# Altium project diplomka_hiearchical.PrjPcb (part 1 of 4)
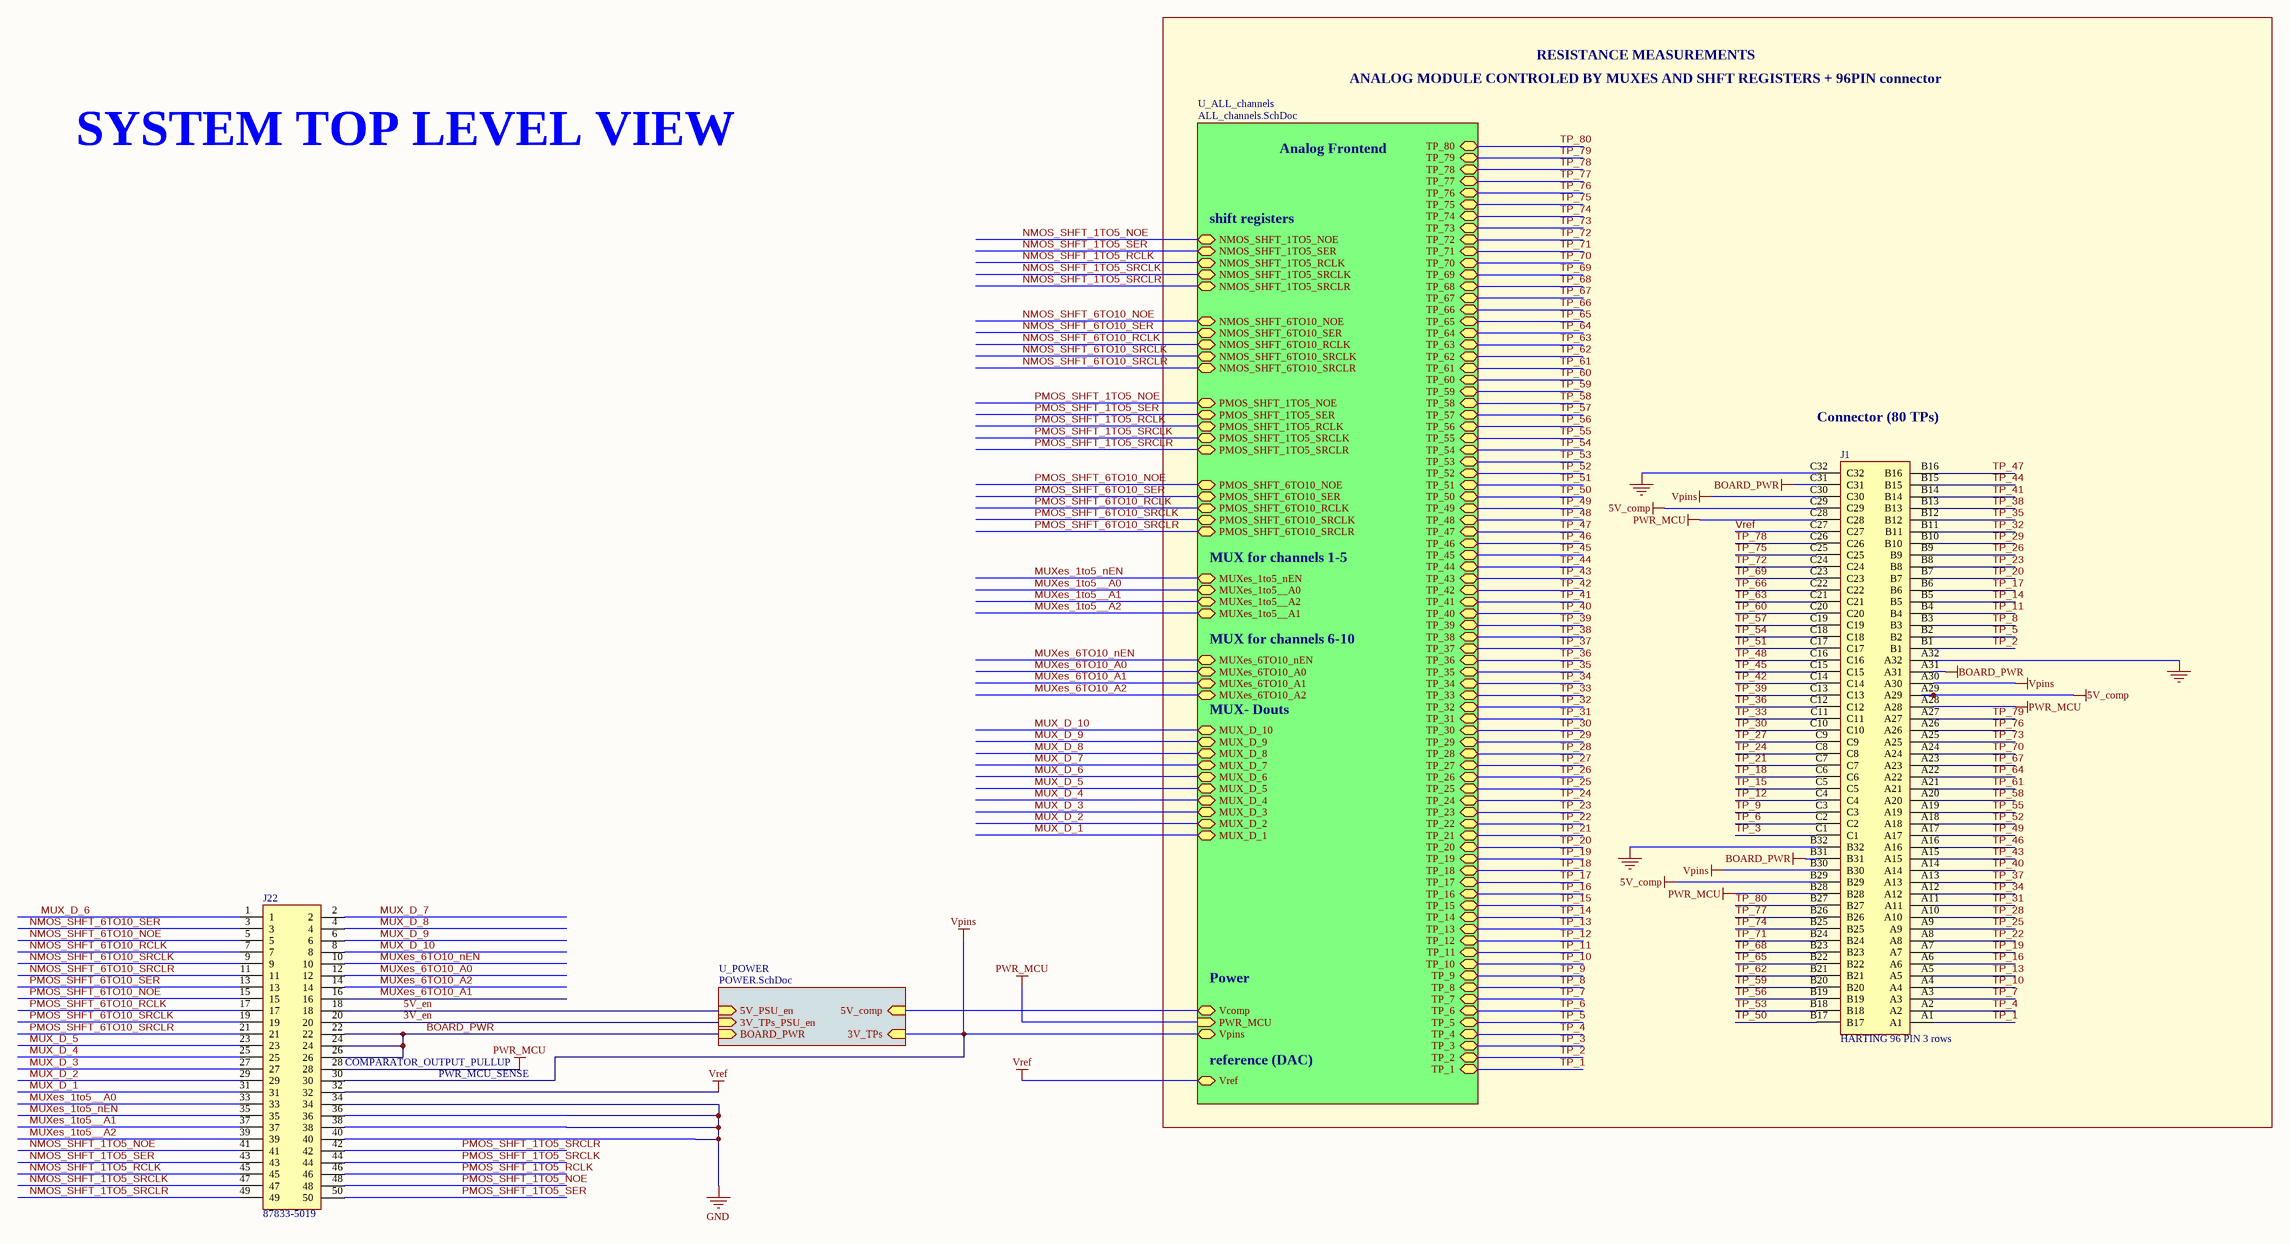
[diagram p0: main_scheme.SchDoc]
5 sheets, 444 parts. Net scope: hierarchical (ports join the sheet entries above them; power ports are global).
Board file: PCB1.PcbDoc
Sheets:
  main_scheme.SchDoc
    U_ALL_channels = ALL_channels.SchDoc
      8pins1 = 8pins_together.SchDoc
        dTP = TPs.SchDoc
        dTP = TPs.SchDoc
        dTP = TPs.SchDoc
        dTP = TPs.SchDoc
      8pins2 = 8pins_together.SchDoc
        dTP = TPs.SchDoc
        dTP = TPs.SchDoc
        dTP = TPs.SchDoc
        dTP = TPs.SchDoc
      8pins3 = 8pins_together.SchDoc
        dTP = TPs.SchDoc
        dTP = TPs.SchDoc
        dTP = TPs.SchDoc
        dTP = TPs.SchDoc
      8pins4 = 8pins_together.SchDoc
        dTP = TPs.SchDoc
        dTP = TPs.SchDoc
        dTP = TPs.SchDoc
        dTP = TPs.SchDoc
      8pins5 = 8pins_together.SchDoc
        dTP = TPs.SchDoc
        dTP = TPs.SchDoc
        dTP = TPs.SchDoc
        dTP = TPs.SchDoc
      8pins6 = 8pins_together.SchDoc
        dTP = TPs.SchDoc
        dTP = TPs.SchDoc
        dTP = TPs.SchDoc
        dTP = TPs.SchDoc
      8pins7 = 8pins_together.SchDoc
        dTP = TPs.SchDoc
        dTP = TPs.SchDoc
        dTP = TPs.SchDoc
        dTP = TPs.SchDoc
      8pins8 = 8pins_together.SchDoc
        dTP = TPs.SchDoc
        dTP = TPs.SchDoc
        dTP = TPs.SchDoc
        dTP = TPs.SchDoc
      8pins9 = 8pins_together.SchDoc
        dTP = TPs.SchDoc
        dTP = TPs.SchDoc
        dTP = TPs.SchDoc
        dTP = TPs.SchDoc
      8pins10 = 8pins_together.SchDoc
        dTP = TPs.SchDoc
        dTP = TPs.SchDoc
        dTP = TPs.SchDoc
        dTP = TPs.SchDoc
    U_POWER = POWER.SchDoc

## Sheet main_scheme.SchDoc
size A2; DocumentNumber: 1; SheetNumber: 1; SheetTotal: 5

### Parts
J1  HARTING 96 PIN 3 rows  [09033966921]
J22  87833-5019  [SHDRRA50W55P200_2X25_5265X640X630P]

### Sub-sheets
U_ALL_channels = ALL_channels.SchDoc: NMOS_SHFT_1TO5_SER (bidir), NMOS_SHFT_1TO5_NOE (bidir), NMOS_SHFT_1TO5_SRCLR (bidir), NMOS_SHFT_1TO5_SRCLK (bidir), NMOS_SHFT_1TO5_RCLK (bidir), PMOS_SHFT_1TO5_SER (bidir), PMOS_SHFT_1TO5_NOE (bidir), PMOS_SHFT_1TO5_SRCLR (bidir), PMOS_SHFT_1TO5_SRCLK (bidir), PMOS_SHFT_1TO5_RCLK (bidir), TP_1 (bidir), TP_2 (bidir), TP_3 (bidir), TP_4 (bidir), TP_5 (bidir), TP_6 (bidir), TP_7 (bidir), TP_8 (bidir), TP_9 (bidir), TP_10 (bidir), TP_11 (bidir), TP_12 (bidir), TP_13 (bidir), TP_14 (bidir), TP_15 (bidir), TP_16 (bidir), TP_17 (bidir), TP_18 (bidir), TP_19 (bidir), TP_20 (bidir), TP_21 (bidir), TP_22 (bidir), TP_23 (bidir), TP_24 (bidir), TP_25 (bidir), TP_26 (bidir), TP_27 (bidir), TP_28 (bidir), TP_29 (bidir), TP_30 (bidir), TP_31 (bidir), TP_32 (bidir), TP_33 (bidir), TP_34 (bidir), TP_35 (bidir), TP_36 (bidir), TP_37 (bidir), TP_38 (bidir), TP_39 (bidir), TP_40 (bidir), MUX_D_1 (bidir), NMOS_SHFT_6TO10_SER (bidir), NMOS_SHFT_6TO10_NOE (bidir), NMOS_SHFT_6TO10_SRCLR (bidir), NMOS_SHFT_6TO10_SRCLK (bidir), NMOS_SHFT_6TO10_RCLK (bidir), PMOS_SHFT_6TO10_SER (bidir), PMOS_SHFT_6TO10_NOE (bidir), PMOS_SHFT_6TO10_SRCLR (bidir), PMOS_SHFT_6TO10_SRCLK (bidir), PMOS_SHFT_6TO10_RCLK (bidir), MUX_D_2 (bidir), MUX_D_3 (bidir), MUX_D_4 (bidir), MUX_D_5 (bidir), MUX_D_6 (bidir), MUX_D_7 (bidir), MUX_D_8 (bidir), MUX_D_9 (bidir), MUX_D_10 (bidir), MUXes_1to5_nEN (bidir), MUXes_1to5__A0 (bidir), MUXes_1to5__A1 (bidir), MUXes_1to5__A2 (bidir), MUXes_6TO10_nEN (bidir), MUXes_6TO10_A0 (bidir), MUXes_6TO10_A1 (bidir), MUXes_6TO10_A2 (bidir), TP_41 (bidir), TP_42 (bidir), TP_43 (bidir), TP_44 (bidir), TP_45 (bidir), TP_46 (bidir), TP_47 (bidir), TP_48 (bidir), TP_49 (bidir), TP_50 (bidir), TP_51 (bidir), TP_52 (bidir), TP_53 (bidir), TP_54 (bidir), TP_55 (bidir), TP_56 (bidir), TP_57 (bidir), TP_58 (bidir), TP_59 (bidir), TP_60 (bidir), TP_61 (bidir), TP_62 (bidir), TP_63 (bidir), TP_64 (bidir), TP_65 (bidir), TP_66 (bidir), TP_67 (bidir), TP_68 (bidir), TP_69 (bidir), TP_70 (bidir), TP_71 (bidir), TP_72 (bidir), TP_73 (bidir), TP_74 (bidir), TP_75 (bidir), TP_76 (bidir), TP_77 (bidir), TP_78 (bidir), TP_79 (bidir), TP_80 (bidir), Vcomp (bidir), Vref (bidir), PWR_MCU (in), Vpins (bidir)
U_POWER = POWER.SchDoc: 3V_TPs (in), 3V_TPs_PSU_en (in), 5V_PSU_en (in), BOARD_PWR (in), 5V_comp (in)

### Nets
5V_comp: J1.A29 J1.B29 J1.C29
BOARD_PWR: J1.A31 J1.B31 J1.C31 J22.22 J22.24 J22.26 ; sheet U_POWER/BOARD_PWR
GND: J1.A32 J1.B32 J1.C32 J22.34 J22.36 J22.38 J22.40
PWR_MCU: J1.A28 J1.B28 J1.C28 J22.28 ; sheet U_ALL_channels/PWR_MCU
Vpins: J1.A30 J1.B30 J1.C30 J22.30 ; sheet U_ALL_channels/Vpins, sheet U_POWER/3V_TPs
Vref: J1.C27 J22.32 ; sheet U_ALL_channels/Vref
3V_en: J22.20 ; sheet U_POWER/3V_TPs_PSU_en
5V_en: J22.18 ; sheet U_POWER/5V_PSU_en
MUX_D_1: J22.31 ; sheet U_ALL_channels/MUX_D_1
MUX_D_2: J22.29 ; sheet U_ALL_channels/MUX_D_2
MUX_D_3: J22.27 ; sheet U_ALL_channels/MUX_D_3
MUX_D_4: J22.25 ; sheet U_ALL_channels/MUX_D_4
MUX_D_5: J22.23 ; sheet U_ALL_channels/MUX_D_5
MUX_D_6: J22.1 ; sheet U_ALL_channels/MUX_D_6
MUX_D_7: J22.2 ; sheet U_ALL_channels/MUX_D_7
MUX_D_8: J22.4 ; sheet U_ALL_channels/MUX_D_8
MUX_D_9: J22.6 ; sheet U_ALL_channels/MUX_D_9
MUX_D_10: J22.8 ; sheet U_ALL_channels/MUX_D_10
MUXes_1to5__A0: J22.33 ; sheet U_ALL_channels/MUXes_1to5__A0
MUXes_1to5__A1: J22.37 ; sheet U_ALL_channels/MUXes_1to5__A2
MUXes_1to5__A2: J22.39 ; sheet U_ALL_channels/MUXes_1to5__A1
MUXes_1to5_nEN: J22.35 ; sheet U_ALL_channels/MUXes_1to5_nEN
MUXes_6TO10_A0: J22.12 ; sheet U_ALL_channels/MUXes_6TO10_A0
MUXes_6TO10_A1: J22.16 ; sheet U_ALL_channels/MUXes_6TO10_A1
MUXes_6TO10_A2: J22.14 ; sheet U_ALL_channels/MUXes_6TO10_A2
MUXes_6TO10_nEN: J22.10 ; sheet U_ALL_channels/MUXes_6TO10_nEN
NMOS_SHFT_1TO5_NOE: J22.41 ; sheet U_ALL_channels/NMOS_SHFT_1TO5_NOE
NMOS_SHFT_1TO5_RCLK: J22.45 ; sheet U_ALL_channels/NMOS_SHFT_1TO5_RCLK
NMOS_SHFT_1TO5_SER: J22.43 ; sheet U_ALL_channels/NMOS_SHFT_1TO5_SER
NMOS_SHFT_1TO5_SRCLK: J22.47 ; sheet U_ALL_channels/NMOS_SHFT_1TO5_SRCLK
NMOS_SHFT_1TO5_SRCLR: J22.49 ; sheet U_ALL_channels/NMOS_SHFT_1TO5_SRCLR
NMOS_SHFT_6TO10_NOE: J22.5 ; sheet U_ALL_channels/NMOS_SHFT_6TO10_NOE
NMOS_SHFT_6TO10_RCLK: J22.7 ; sheet U_ALL_channels/NMOS_SHFT_6TO10_RCLK
NMOS_SHFT_6TO10_SER: J22.3 ; sheet U_ALL_channels/NMOS_SHFT_6TO10_SER
NMOS_SHFT_6TO10_SRCLK: J22.9 ; sheet U_ALL_channels/NMOS_SHFT_6TO10_SRCLK
NMOS_SHFT_6TO10_SRCLR: J22.11 ; sheet U_ALL_channels/NMOS_SHFT_6TO10_SRCLR
PMOS_SHFT_1TO5_NOE: J22.48 ; sheet U_ALL_channels/PMOS_SHFT_1TO5_NOE
PMOS_SHFT_1TO5_RCLK: J22.46 ; sheet U_ALL_channels/PMOS_SHFT_1TO5_RCLK
PMOS_SHFT_1TO5_SER: J22.50 ; sheet U_ALL_channels/PMOS_SHFT_1TO5_SER
PMOS_SHFT_1TO5_SRCLK: J22.44 ; sheet U_ALL_channels/PMOS_SHFT_1TO5_SRCLK
PMOS_SHFT_1TO5_SRCLR: J22.42 ; sheet U_ALL_channels/PMOS_SHFT_1TO5_SRCLR
PMOS_SHFT_6TO10_NOE: J22.15 ; sheet U_ALL_channels/PMOS_SHFT_6TO10_NOE
PMOS_SHFT_6TO10_RCLK: J22.17 ; sheet U_ALL_channels/PMOS_SHFT_6TO10_RCLK
PMOS_SHFT_6TO10_SER: J22.13 ; sheet U_ALL_channels/PMOS_SHFT_6TO10_SER
PMOS_SHFT_6TO10_SRCLK: J22.19 ; sheet U_ALL_channels/PMOS_SHFT_6TO10_SRCLK
PMOS_SHFT_6TO10_SRCLR: J22.21 ; sheet U_ALL_channels/PMOS_SHFT_6TO10_SRCLR
TP_1: J1.A1 ; sheet U_ALL_channels/TP_1
TP_2: J1.B1 ; sheet U_ALL_channels/TP_2
TP_3: J1.C1 ; sheet U_ALL_channels/TP_3
TP_4: J1.A2 ; sheet U_ALL_channels/TP_4
TP_5: J1.B2 ; sheet U_ALL_channels/TP_5
TP_6: J1.C2 ; sheet U_ALL_channels/TP_6
TP_7: J1.A3 ; sheet U_ALL_channels/TP_7
TP_8: J1.B3 ; sheet U_ALL_channels/TP_8
TP_9: J1.C3 ; sheet U_ALL_channels/TP_9
TP_10: J1.A4 ; sheet U_ALL_channels/TP_10
TP_11: J1.B4 ; sheet U_ALL_channels/TP_11
TP_12: J1.C4 ; sheet U_ALL_channels/TP_12
TP_13: J1.A5 ; sheet U_ALL_channels/TP_13
TP_14: J1.B5 ; sheet U_ALL_channels/TP_14
TP_15: J1.C5 ; sheet U_ALL_channels/TP_15
TP_16: J1.A6 ; sheet U_ALL_channels/TP_16
TP_17: J1.B6 ; sheet U_ALL_channels/TP_17
TP_18: J1.C6 ; sheet U_ALL_channels/TP_18
TP_19: J1.A7 ; sheet U_ALL_channels/TP_19
TP_20: J1.B7 ; sheet U_ALL_channels/TP_20
TP_21: J1.C7 ; sheet U_ALL_channels/TP_21
TP_22: J1.A8 ; sheet U_ALL_channels/TP_22
TP_23: J1.B8 ; sheet U_ALL_channels/TP_23
TP_24: J1.C8 ; sheet U_ALL_channels/TP_24
TP_25: J1.A9 ; sheet U_ALL_channels/TP_25
TP_26: J1.B9 ; sheet U_ALL_channels/TP_26
TP_27: J1.C9 ; sheet U_ALL_channels/TP_27
TP_28: J1.A10 ; sheet U_ALL_channels/TP_28
TP_29: J1.B10 ; sheet U_ALL_channels/TP_29
TP_30: J1.C10 ; sheet U_ALL_channels/TP_30
TP_31: J1.A11 ; sheet U_ALL_channels/TP_31
TP_32: J1.B11 ; sheet U_ALL_channels/TP_32
TP_33: J1.C11 ; sheet U_ALL_channels/TP_33
TP_34: J1.A12 ; sheet U_ALL_channels/TP_34
TP_35: J1.B12 ; sheet U_ALL_channels/TP_35
TP_36: J1.C12 ; sheet U_ALL_channels/TP_36
TP_37: J1.A13 ; sheet U_ALL_channels/TP_37
TP_38: J1.B13 ; sheet U_ALL_channels/TP_38
TP_39: J1.C13 ; sheet U_ALL_channels/TP_39
TP_40: J1.A14 ; sheet U_ALL_channels/TP_40
TP_41: J1.B14 ; sheet U_ALL_channels/TP_41
TP_42: J1.C14 ; sheet U_ALL_channels/TP_42
TP_43: J1.A15 ; sheet U_ALL_channels/TP_43
TP_44: J1.B15 ; sheet U_ALL_channels/TP_44
TP_45: J1.C15 ; sheet U_ALL_channels/TP_45
TP_46: J1.A16 ; sheet U_ALL_channels/TP_46
TP_47: J1.B16 ; sheet U_ALL_channels/TP_47
TP_48: J1.C16 ; sheet U_ALL_channels/TP_48
TP_49: J1.A17 ; sheet U_ALL_channels/TP_49
TP_50: J1.B17 ; sheet U_ALL_channels/TP_50
TP_51: J1.C17 ; sheet U_ALL_channels/TP_51
TP_52: J1.A18 ; sheet U_ALL_channels/TP_52
TP_53: J1.B18 ; sheet U_ALL_channels/TP_53
TP_54: J1.C18 ; sheet U_ALL_channels/TP_54
TP_55: J1.A19 ; sheet U_ALL_channels/TP_55
TP_56: J1.B19 ; sheet U_ALL_channels/TP_56
TP_57: J1.C19 ; sheet U_ALL_channels/TP_57
TP_58: J1.A20 ; sheet U_ALL_channels/TP_58
TP_59: J1.B20 ; sheet U_ALL_channels/TP_59
TP_60: J1.C20 ; sheet U_ALL_channels/TP_60
TP_61: J1.A21 ; sheet U_ALL_channels/TP_61
TP_62: J1.B21 ; sheet U_ALL_channels/TP_62
TP_63: J1.C21 ; sheet U_ALL_channels/TP_63
TP_64: J1.A22 ; sheet U_ALL_channels/TP_64
TP_65: J1.B22 ; sheet U_ALL_channels/TP_65
TP_66: J1.C22 ; sheet U_ALL_channels/TP_66
TP_67: J1.A23 ; sheet U_ALL_channels/TP_67
TP_68: J1.B23 ; sheet U_ALL_channels/TP_68
TP_69: J1.C23 ; sheet U_ALL_channels/TP_69
TP_70: J1.A24 ; sheet U_ALL_channels/TP_70
TP_71: J1.B24 ; sheet U_ALL_channels/TP_71
TP_72: J1.C24 ; sheet U_ALL_channels/TP_72
TP_73: J1.A25 ; sheet U_ALL_channels/TP_73
TP_74: J1.B25 ; sheet U_ALL_channels/TP_74
TP_75: J1.C25 ; sheet U_ALL_channels/TP_75
TP_76: J1.A26 ; sheet U_ALL_channels/TP_76
TP_77: J1.B26 ; sheet U_ALL_channels/TP_77
TP_78: J1.C26 ; sheet U_ALL_channels/TP_78
TP_79: J1.A27 ; sheet U_ALL_channels/TP_79
TP_80: J1.B27 ; sheet U_ALL_channels/TP_80
Vcomp: sheet U_ALL_channels/Vcomp, sheet U_POWER/5V_comp

### Notes on the sheet
- RESISTANCE MEASUREMENTS
- ANALOG MODULE CONTROLED BY MUXES AND SHFT REGISTERS + 96PIN connector
- SYSTEM TOP LEVEL VIEW
- Analog Frontend
- shift registers
- Connector (80 TPs)
- MUX for channels 1-5
- MUX for channels 6-10
- MUX- Douts
- Power
- (near J22) COMPARATOR_OUTPUT_PULLUP
- reference (DAC)
- PWR_MCU_SENSE

### Library data of the parts
J1 = HARTING 96 PIN 3 rows: Connector; Datasheet Link: https://b2b.harting.com/files/download/PRD/PDF_TS/0903396X921_100072506DRW414C.pdf?showPrivacyEmailAgreement=false&contextURL=https%3A%2F%2Fb2b.harting.com%2Febusiness%2Fen_us&siteName=Ebusiness+Site&autoLogoutEnabled=true&autoLogoutTime=1800; Height: 11.6mm; Manufacturer_Name: HARTING; Manufacturer_Part_Number: 09033966921; Mouser Part Number: 617-09-03-396-6921; Mouser Price/Stock: https://www.mouser.co.uk/ProductDetail/HARTING/09033966921?qs=gIpPgrDBK%2FiSDuMebe5eaQ%3D%3D; Arrow Part Number: 09033966921; Arrow Price/Stock: https://www.arrow.com/en/products/09033966921/harting?region=europe
J22 = 87833-5019: Connector; Manufacturer_Name: Molex; Datasheet Link: https://www.molex.com/pdm_docs/sd/878335019_sd.pdf; Height: 6.3mm; Manufacturer_Part_Number: 87833-5019; Mouser Part Number: 538-87833-5019; Mouser Price/Stock: https://www.mouser.co.uk/ProductDetail/Molex/87833-5019?qs=Vr3ZXvgdfhbSPmsYnBrhlw%3D%3D

## Sheet ALL_channels.SchDoc
size A2; DocumentNumber: 4; SheetNumber: 2; SheetTotal: 5
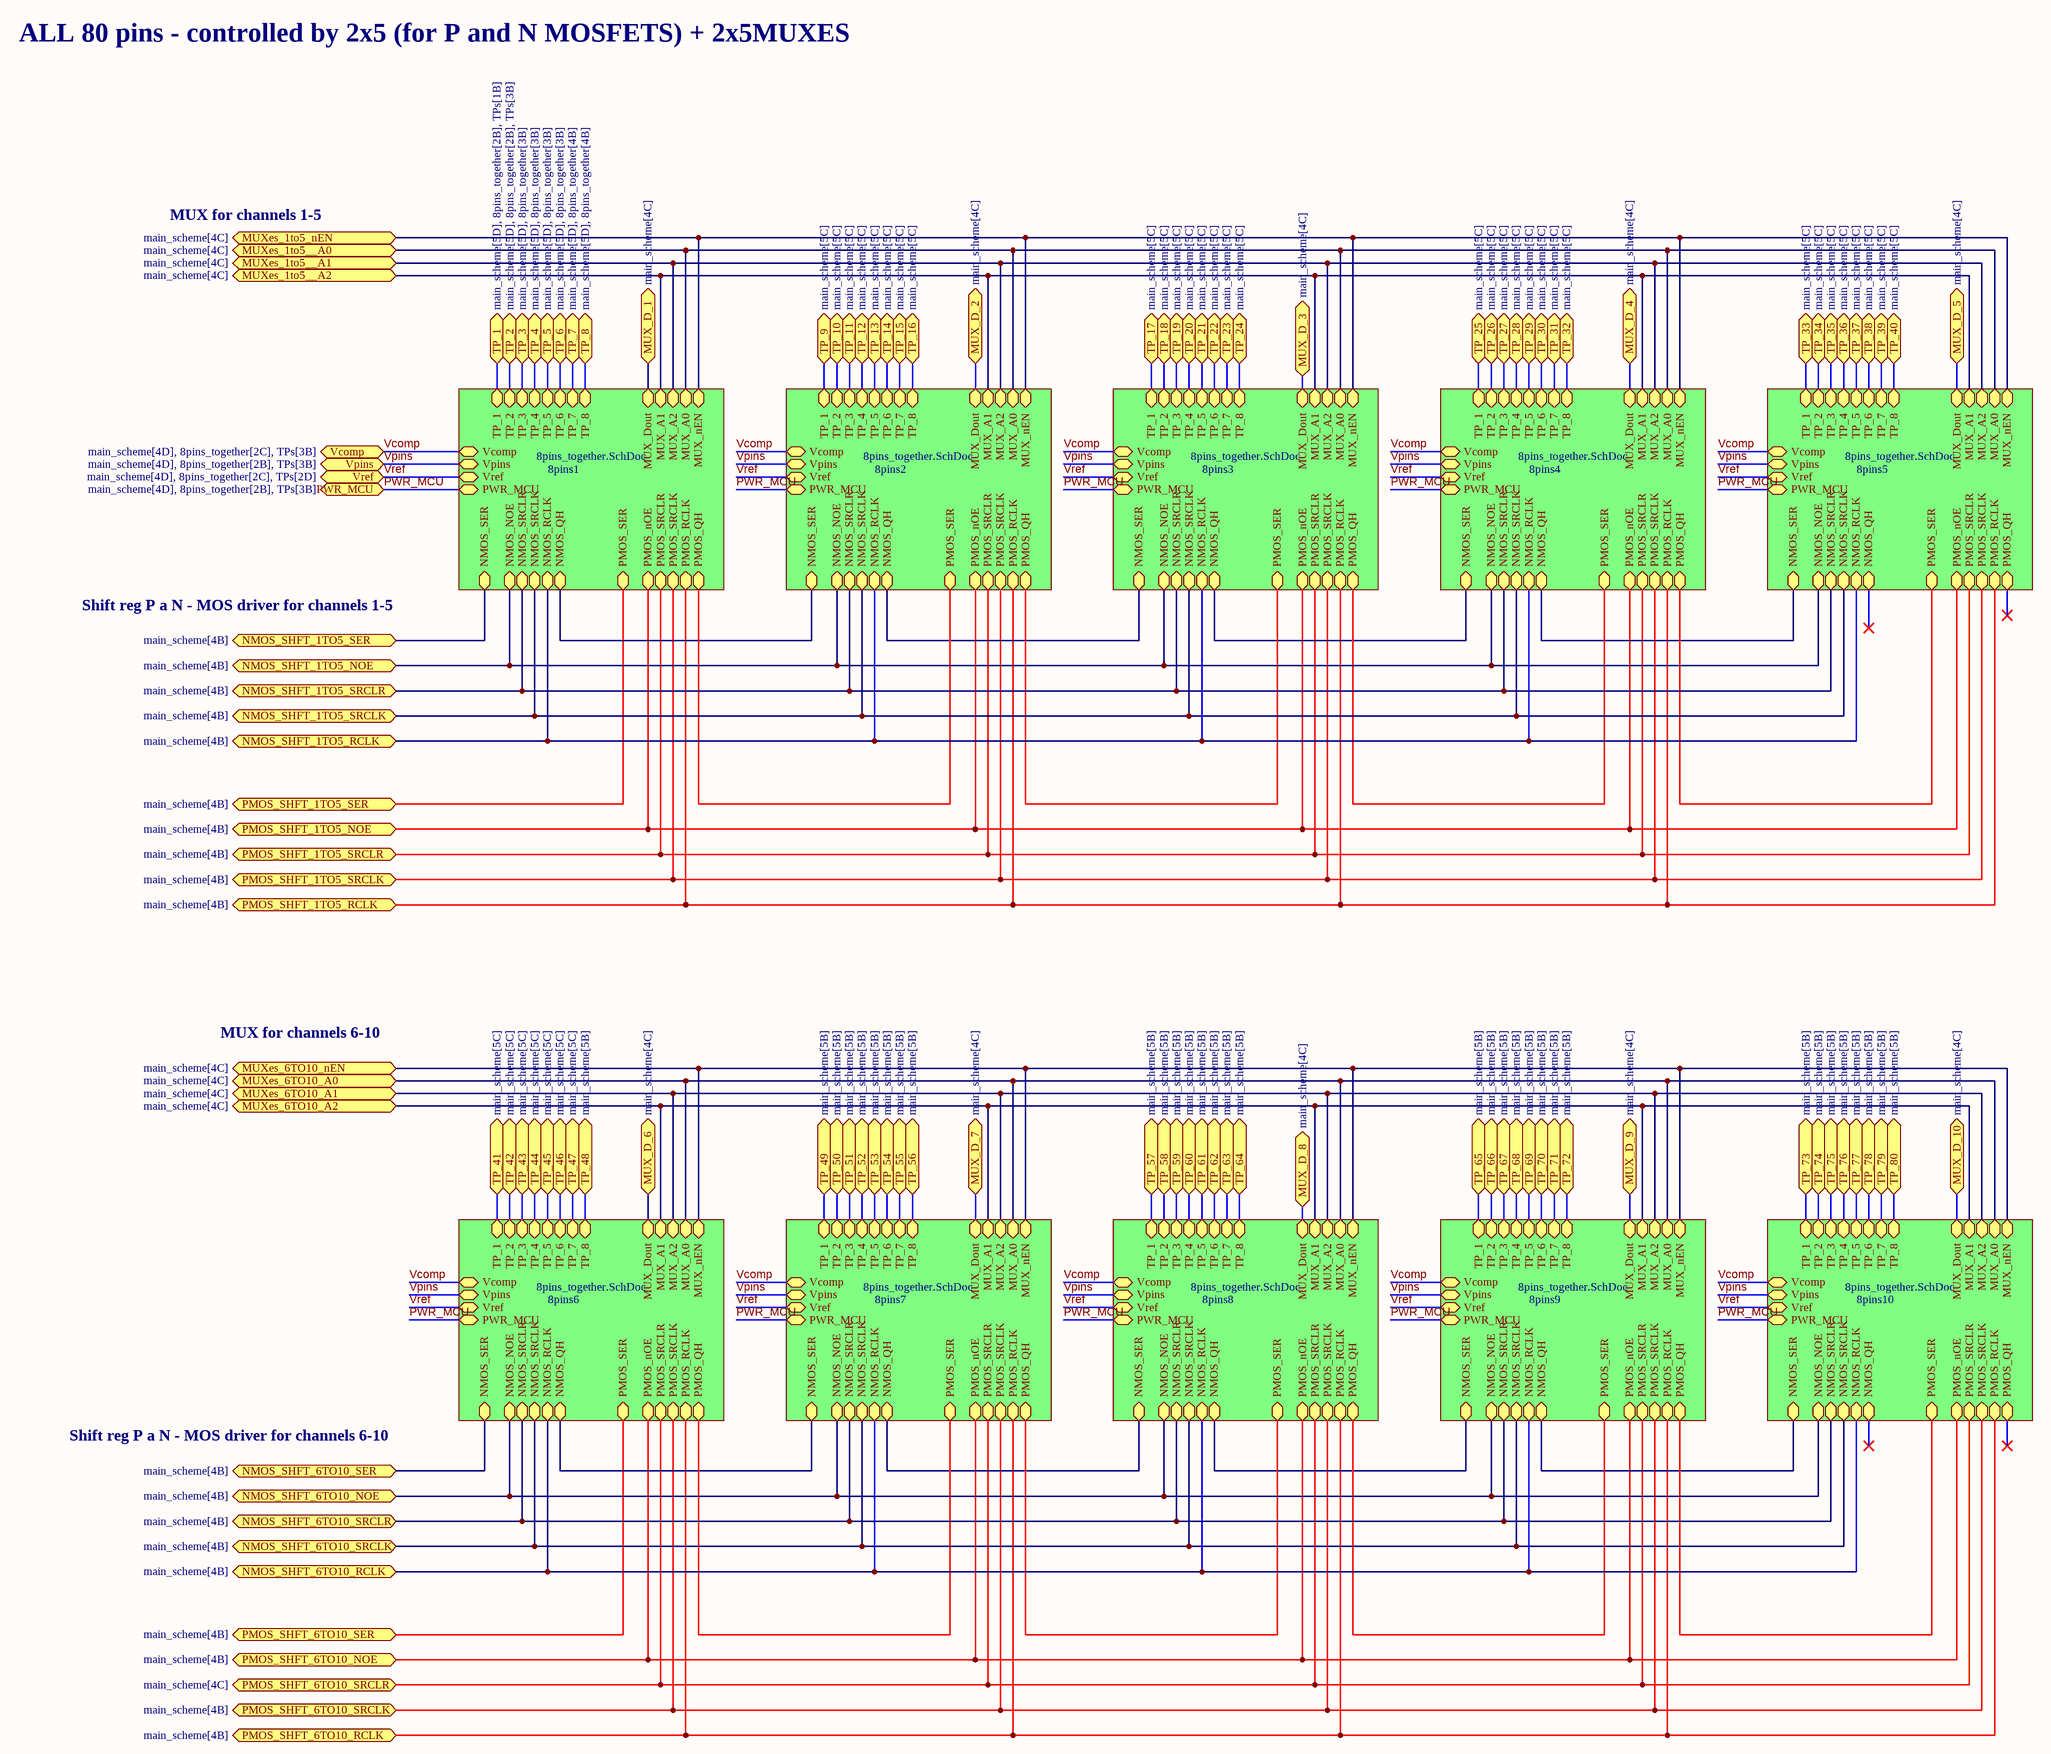
[diagram p1: ALL_channels.SchDoc]

### Sub-sheets
8pins1 = 8pins_together.SchDoc: TP_1 (bidir), TP_2 (bidir), TP_3 (bidir), TP_4 (bidir), TP_5 (bidir), TP_6 (bidir), TP_7 (bidir), TP_8 (bidir), MUX_nEN (bidir), MUX_Dout (bidir), MUX_A0 (bidir), MUX_A1 (bidir), MUX_A2 (bidir), Vcomp (bidir), Vref (bidir), PWR_MCU (bidir), Vpins (bidir), NMOS_QH (bidir), PMOS_QH (bidir), NMOS_RCLK (bidir), NMOS_NOE (bidir), NMOS_SRCLK (bidir), NMOS_SRCLR (bidir), NMOS_SER (bidir), PMOS_RCLK (bidir), PMOS_nOE (bidir), PMOS_SRCLK (bidir), PMOS_SRCLR (bidir), PMOS_SER (bidir)
8pins2 = 8pins_together.SchDoc: TP_1 (bidir), TP_2 (bidir), TP_3 (bidir), TP_4 (bidir), TP_5 (bidir), TP_6 (bidir), TP_7 (bidir), TP_8 (bidir), MUX_nEN (bidir), MUX_Dout (bidir), MUX_A0 (bidir), MUX_A1 (bidir), MUX_A2 (bidir), Vcomp (bidir), Vref (bidir), PWR_MCU (bidir), Vpins (bidir), NMOS_QH (bidir), PMOS_QH (bidir), NMOS_RCLK (bidir), NMOS_NOE (bidir), NMOS_SRCLK (bidir), NMOS_SRCLR (bidir), NMOS_SER (bidir), PMOS_RCLK (bidir), PMOS_nOE (bidir), PMOS_SRCLK (bidir), PMOS_SRCLR (bidir), PMOS_SER (bidir)
8pins3 = 8pins_together.SchDoc: TP_1 (bidir), TP_2 (bidir), TP_3 (bidir), TP_4 (bidir), TP_5 (bidir), TP_6 (bidir), TP_7 (bidir), TP_8 (bidir), MUX_nEN (bidir), MUX_Dout (bidir), MUX_A0 (bidir), MUX_A1 (bidir), MUX_A2 (bidir), Vcomp (bidir), Vref (bidir), PWR_MCU (bidir), Vpins (bidir), NMOS_QH (bidir), PMOS_QH (bidir), NMOS_RCLK (bidir), NMOS_NOE (bidir), NMOS_SRCLK (bidir), NMOS_SRCLR (bidir), NMOS_SER (bidir), PMOS_RCLK (bidir), PMOS_nOE (bidir), PMOS_SRCLK (bidir), PMOS_SRCLR (bidir), PMOS_SER (bidir)
8pins4 = 8pins_together.SchDoc: TP_1 (bidir), TP_2 (bidir), TP_3 (bidir), TP_4 (bidir), TP_5 (bidir), TP_6 (bidir), TP_7 (bidir), TP_8 (bidir), MUX_nEN (bidir), MUX_Dout (bidir), MUX_A0 (bidir), MUX_A1 (bidir), MUX_A2 (bidir), Vcomp (bidir), Vref (bidir), PWR_MCU (bidir), Vpins (bidir), NMOS_QH (bidir), PMOS_QH (bidir), NMOS_RCLK (bidir), NMOS_NOE (bidir), NMOS_SRCLK (bidir), NMOS_SRCLR (bidir), NMOS_SER (bidir), PMOS_RCLK (bidir), PMOS_nOE (bidir), PMOS_SRCLK (bidir), PMOS_SRCLR (bidir), PMOS_SER (bidir)
8pins5 = 8pins_together.SchDoc: TP_1 (bidir), TP_2 (bidir), TP_3 (bidir), TP_4 (bidir), TP_5 (bidir), TP_6 (bidir), TP_7 (bidir), TP_8 (bidir), MUX_nEN (bidir), MUX_Dout (bidir), MUX_A0 (bidir), MUX_A1 (bidir), MUX_A2 (bidir), Vcomp (bidir), Vref (bidir), PWR_MCU (bidir), Vpins (bidir), NMOS_QH (bidir), PMOS_QH (bidir), NMOS_RCLK (bidir), NMOS_NOE (bidir), NMOS_SRCLK (bidir), NMOS_SRCLR (bidir), NMOS_SER (bidir), PMOS_RCLK (bidir), PMOS_nOE (bidir), PMOS_SRCLK (bidir), PMOS_SRCLR (bidir), PMOS_SER (bidir)
8pins6 = 8pins_together.SchDoc: TP_1 (bidir), TP_2 (bidir), TP_3 (bidir), TP_4 (bidir), TP_5 (bidir), TP_6 (bidir), TP_7 (bidir), TP_8 (bidir), MUX_nEN (bidir), MUX_Dout (bidir), MUX_A0 (bidir), MUX_A1 (bidir), MUX_A2 (bidir), Vcomp (bidir), Vref (bidir), PWR_MCU (bidir), Vpins (bidir), NMOS_QH (bidir), PMOS_QH (bidir), NMOS_RCLK (bidir), NMOS_NOE (bidir), NMOS_SRCLK (bidir), NMOS_SRCLR (bidir), NMOS_SER (bidir), PMOS_RCLK (bidir), PMOS_nOE (bidir), PMOS_SRCLK (bidir), PMOS_SRCLR (bidir), PMOS_SER (bidir)
8pins7 = 8pins_together.SchDoc: TP_1 (bidir), TP_2 (bidir), TP_3 (bidir), TP_4 (bidir), TP_5 (bidir), TP_6 (bidir), TP_7 (bidir), TP_8 (bidir), MUX_nEN (bidir), MUX_Dout (bidir), MUX_A0 (bidir), MUX_A1 (bidir), MUX_A2 (bidir), Vcomp (bidir), Vref (bidir), PWR_MCU (bidir), Vpins (bidir), NMOS_QH (bidir), PMOS_QH (bidir), NMOS_RCLK (bidir), NMOS_NOE (bidir), NMOS_SRCLK (bidir), NMOS_SRCLR (bidir), NMOS_SER (bidir), PMOS_RCLK (bidir), PMOS_nOE (bidir), PMOS_SRCLK (bidir), PMOS_SRCLR (bidir), PMOS_SER (bidir)
8pins8 = 8pins_together.SchDoc: TP_1 (bidir), TP_2 (bidir), TP_3 (bidir), TP_4 (bidir), TP_5 (bidir), TP_6 (bidir), TP_7 (bidir), TP_8 (bidir), MUX_nEN (bidir), MUX_Dout (bidir), MUX_A0 (bidir), MUX_A1 (bidir), MUX_A2 (bidir), Vcomp (bidir), Vref (bidir), PWR_MCU (bidir), Vpins (bidir), NMOS_QH (bidir), PMOS_QH (bidir), NMOS_RCLK (bidir), NMOS_NOE (bidir), NMOS_SRCLK (bidir), NMOS_SRCLR (bidir), NMOS_SER (bidir), PMOS_RCLK (bidir), PMOS_nOE (bidir), PMOS_SRCLK (bidir), PMOS_SRCLR (bidir), PMOS_SER (bidir)
8pins9 = 8pins_together.SchDoc: TP_1 (bidir), TP_2 (bidir), TP_3 (bidir), TP_4 (bidir), TP_5 (bidir), TP_6 (bidir), TP_7 (bidir), TP_8 (bidir), MUX_nEN (bidir), MUX_Dout (bidir), MUX_A0 (bidir), MUX_A1 (bidir), MUX_A2 (bidir), Vcomp (bidir), Vref (bidir), PWR_MCU (bidir), Vpins (bidir), NMOS_QH (bidir), PMOS_QH (bidir), NMOS_RCLK (bidir), NMOS_NOE (bidir), NMOS_SRCLK (bidir), NMOS_SRCLR (bidir), NMOS_SER (bidir), PMOS_RCLK (bidir), PMOS_nOE (bidir), PMOS_SRCLK (bidir), PMOS_SRCLR (bidir), PMOS_SER (bidir)
8pins10 = 8pins_together.SchDoc: TP_1 (bidir), TP_2 (bidir), TP_3 (bidir), TP_4 (bidir), TP_5 (bidir), TP_6 (bidir), TP_7 (bidir), TP_8 (bidir), MUX_nEN (bidir), MUX_Dout (bidir), MUX_A0 (bidir), MUX_A1 (bidir), MUX_A2 (bidir), Vcomp (bidir), Vref (bidir), PWR_MCU (bidir), Vpins (bidir), NMOS_QH (bidir), PMOS_QH (bidir), NMOS_RCLK (bidir), NMOS_NOE (bidir), NMOS_SRCLK (bidir), NMOS_SRCLR (bidir), NMOS_SER (bidir), PMOS_RCLK (bidir), PMOS_nOE (bidir), PMOS_SRCLK (bidir), PMOS_SRCLR (bidir), PMOS_SER (bidir)

### Ports
MUX_D_1 (bidir, see main_scheme[4C]), MUX_D_2 (bidir, see main_scheme[4C]), MUX_D_3 (bidir, see main_scheme[4C]), MUX_D_4 (bidir, see main_scheme[4C]), MUX_D_5 (bidir, see main_scheme[4C]), MUX_D_6 (bidir, see main_scheme[4C]), MUX_D_7 (bidir, see main_scheme[4C]), MUX_D_8 (bidir, see main_scheme[4C]), MUX_D_9 (bidir, see main_scheme[4C]), MUX_D_10 (bidir, see main_scheme[4C]), MUXes_1to5__A0 (bidir, see main_scheme[4C]), MUXes_1to5__A1 (bidir, see main_scheme[4C]), MUXes_1to5__A2 (bidir, see main_scheme[4C]), MUXes_1to5_nEN (bidir, see main_scheme[4C]), MUXes_6TO10_A0 (bidir, see main_scheme[4C]), MUXes_6TO10_A1 (bidir, see main_scheme[4C]), MUXes_6TO10_A2 (bidir, see main_scheme[4C]), MUXes_6TO10_nEN (bidir, see main_scheme[4C]), NMOS_SHFT_1TO5_NOE (bidir, see main_scheme[4B]), NMOS_SHFT_1TO5_RCLK (bidir, see main_scheme[4B]), NMOS_SHFT_1TO5_SER (bidir, see main_scheme[4B]), NMOS_SHFT_1TO5_SRCLK (bidir, see main_scheme[4B]), NMOS_SHFT_1TO5_SRCLR (bidir, see main_scheme[4B]), NMOS_SHFT_6TO10_NOE (bidir, see main_scheme[4B]), NMOS_SHFT_6TO10_RCLK (bidir, see main_scheme[4B]), NMOS_SHFT_6TO10_SER (bidir, see main_scheme[4B]), NMOS_SHFT_6TO10_SRCLK (bidir, see main_scheme[4B]), NMOS_SHFT_6TO10_SRCLR (bidir, see main_scheme[4B]), PMOS_SHFT_1TO5_NOE (bidir, see main_scheme[4B]), PMOS_SHFT_1TO5_RCLK (bidir, see main_scheme[4B]), PMOS_SHFT_1TO5_SER (bidir, see main_scheme[4B]), PMOS_SHFT_1TO5_SRCLK (bidir, see main_scheme[4B]), PMOS_SHFT_1TO5_SRCLR (bidir, see main_scheme[4B]), PMOS_SHFT_6TO10_NOE (bidir, see main_scheme[4B]), PMOS_SHFT_6TO10_RCLK (bidir, see main_scheme[4B]), PMOS_SHFT_6TO10_SER (bidir, see main_scheme[4B]), PMOS_SHFT_6TO10_SRCLK (bidir, see main_scheme[4B]), PMOS_SHFT_6TO10_SRCLR (bidir, see main_scheme[4C]), PWR_MCU (bidir, see main_scheme[4D], 8pins_together[2B], TPs[3B]), TP_1 (bidir, see main_scheme[5D], 8pins_together[2B], TPs[1B]), TP_2 (bidir, see main_scheme[5D], 8pins_together[2B], TPs[3B]), TP_3 (bidir, see main_scheme[5D], 8pins_together[3B]), TP_4 (bidir, see main_scheme[5D], 8pins_together[3B]), TP_5 (bidir, see main_scheme[5D], 8pins_together[3B]), TP_6 (bidir, see main_scheme[5D], 8pins_together[3B]), TP_7 (bidir, see main_scheme[5D], 8pins_together[4B]), TP_8 (bidir, see main_scheme[5D], 8pins_together[4B]), TP_9 (bidir, see main_scheme[5C]), TP_10 (bidir, see main_scheme[5C]), TP_11 (bidir, see main_scheme[5C]), TP_12 (bidir, see main_scheme[5C]), TP_13 (bidir, see main_scheme[5C]), TP_14 (bidir, see main_scheme[5C]), TP_15 (bidir, see main_scheme[5C]), TP_16 (bidir, see main_scheme[5C]), TP_17 (bidir, see main_scheme[5C]), TP_18 (bidir, see main_scheme[5C]), TP_19 (bidir, see main_scheme[5C]), TP_20 (bidir, see main_scheme[5C]), TP_21 (bidir, see main_scheme[5C]), TP_22 (bidir, see main_scheme[5C]), TP_23 (bidir, see main_scheme[5C]), TP_24 (bidir, see main_scheme[5C]), TP_25 (bidir, see main_scheme[5C]), TP_26 (bidir, see main_scheme[5C]), TP_27 (bidir, see main_scheme[5C]), TP_28 (bidir, see main_scheme[5C]), TP_29 (bidir, see main_scheme[5C]), TP_30 (bidir, see main_scheme[5C]), TP_31 (bidir, see main_scheme[5C]), TP_32 (bidir, see main_scheme[5C]), TP_33 (bidir, see main_scheme[5C]), TP_34 (bidir, see main_scheme[5C]), TP_35 (bidir, see main_scheme[5C]), TP_36 (bidir, see main_scheme[5C]), TP_37 (bidir, see main_scheme[5C]), TP_38 (bidir, see main_scheme[5C]), TP_39 (bidir, see main_scheme[5C]), TP_40 (bidir, see main_scheme[5C]), TP_41 (bidir, see main_scheme[5C]), TP_42 (bidir, see main_scheme[5C]), TP_43 (bidir, see main_scheme[5C]), TP_44 (bidir, see main_scheme[5C]), TP_45 (bidir, see main_scheme[5C]), TP_46 (bidir, see main_scheme[5C]), TP_47 (bidir, see main_scheme[5C]), TP_48 (bidir, see main_scheme[5B]), TP_49 (bidir, see main_scheme[5B]), TP_50 (bidir, see main_scheme[5B]), TP_51 (bidir, see main_scheme[5B]), TP_52 (bidir, see main_scheme[5B]), TP_53 (bidir, see main_scheme[5B]), TP_54 (bidir, see main_scheme[5B]), TP_55 (bidir, see main_scheme[5B]), TP_56 (bidir, see main_scheme[5B]), TP_57 (bidir, see main_scheme[5B]), TP_58 (bidir, see main_scheme[5B]), TP_59 (bidir, see main_scheme[5B]), TP_60 (bidir, see main_scheme[5B]), TP_61 (bidir, see main_scheme[5B]), TP_62 (bidir, see main_scheme[5B]), TP_63 (bidir, see main_scheme[5B]), TP_64 (bidir, see main_scheme[5B]), TP_65 (bidir, see main_scheme[5B]), TP_66 (bidir, see main_scheme[5B]), TP_67 (bidir, see main_scheme[5B]), TP_68 (bidir, see main_scheme[5B]), TP_69 (bidir, see main_scheme[5B]), TP_70 (bidir, see main_scheme[5B]), TP_71 (bidir, see main_scheme[5B]), TP_72 (bidir, see main_scheme[5B]), TP_73 (bidir, see main_scheme[5B]), TP_74 (bidir, see main_scheme[5B]), TP_75 (bidir, see main_scheme[5B]), TP_76 (bidir, see main_scheme[5B]), TP_77 (bidir, see main_scheme[5B]), TP_78 (bidir, see main_scheme[5B]), TP_79 (bidir, see main_scheme[5B]), TP_80 (bidir, see main_scheme[5B]), Vcomp (bidir, see main_scheme[4D], 8pins_together[2C], TPs[3B]), Vpins (bidir, see main_scheme[4D], 8pins_together[2B], TPs[3B]), Vref (bidir, see main_scheme[4D], 8pins_together[2C], TPs[2D])

### Nets
PWR_MCU: port PWR_MCU, sheet 8pins1/PWR_MCU, sheet 8pins2/PWR_MCU, sheet 8pins3/PWR_MCU, sheet 8pins4/PWR_MCU, sheet 8pins5/PWR_MCU, sheet 8pins6/PWR_MCU, sheet 8pins7/PWR_MCU, sheet 8pins8/PWR_MCU, sheet 8pins9/PWR_MCU, sheet 8pins10/PWR_MCU
Vpins: port Vpins, sheet 8pins1/Vpins, sheet 8pins2/Vpins, sheet 8pins3/Vpins, sheet 8pins4/Vpins, sheet 8pins5/Vpins, sheet 8pins6/Vpins, sheet 8pins7/Vpins, sheet 8pins8/Vpins, sheet 8pins9/Vpins, sheet 8pins10/Vpins
Vref: port Vref, sheet 8pins1/Vref, sheet 8pins2/Vref, sheet 8pins3/Vref, sheet 8pins4/Vref, sheet 8pins5/Vref, sheet 8pins6/Vref, sheet 8pins7/Vref, sheet 8pins8/Vref, sheet 8pins9/Vref, sheet 8pins10/Vref
MUX_D_1: port MUX_D_1, sheet 8pins1/MUX_Dout
MUX_D_2: port MUX_D_2, sheet 8pins2/MUX_Dout
MUX_D_3: port MUX_D_3, sheet 8pins3/MUX_Dout
MUX_D_4: port MUX_D_4, sheet 8pins4/MUX_Dout
MUX_D_5: port MUX_D_5, sheet 8pins5/MUX_Dout
MUX_D_6: port MUX_D_6, sheet 8pins6/MUX_Dout
MUX_D_7: port MUX_D_7, sheet 8pins7/MUX_Dout
MUX_D_8: port MUX_D_8, sheet 8pins8/MUX_Dout
MUX_D_9: port MUX_D_9, sheet 8pins9/MUX_Dout
MUX_D_10: port MUX_D_10, sheet 8pins10/MUX_Dout
MUXes_1to5__A0: port MUXes_1to5__A0, sheet 8pins1/MUX_A0, sheet 8pins2/MUX_A0, sheet 8pins3/MUX_A0, sheet 8pins4/MUX_A0, sheet 8pins5/MUX_A0
MUXes_1to5__A1: port MUXes_1to5__A2, sheet 8pins1/MUX_A1, sheet 8pins2/MUX_A1, sheet 8pins3/MUX_A1, sheet 8pins4/MUX_A1, sheet 8pins5/MUX_A1
MUXes_1to5__A2: port MUXes_1to5__A1, sheet 8pins1/MUX_A2, sheet 8pins2/MUX_A2, sheet 8pins3/MUX_A2, sheet 8pins4/MUX_A2, sheet 8pins5/MUX_A2
MUXes_1to5_nEN: port MUXes_1to5_nEN, sheet 8pins1/MUX_nEN, sheet 8pins2/MUX_nEN, sheet 8pins3/MUX_nEN, sheet 8pins4/MUX_nEN, sheet 8pins5/MUX_nEN
MUXes_6TO10_A0: port MUXes_6TO10_A0, sheet 8pins6/MUX_A0, sheet 8pins7/MUX_A0, sheet 8pins8/MUX_A0, sheet 8pins9/MUX_A0, sheet 8pins10/MUX_A0
MUXes_6TO10_A1: port MUXes_6TO10_A1, sheet 8pins6/MUX_A2, sheet 8pins7/MUX_A2, sheet 8pins8/MUX_A2, sheet 8pins9/MUX_A2, sheet 8pins10/MUX_A2
MUXes_6TO10_A2: port MUXes_6TO10_A2, sheet 8pins6/MUX_A1, sheet 8pins7/MUX_A1, sheet 8pins8/MUX_A1, sheet 8pins9/MUX_A1, sheet 8pins10/MUX_A1
MUXes_6TO10_nEN: port MUXes_6TO10_nEN, sheet 8pins6/MUX_nEN, sheet 8pins7/MUX_nEN, sheet 8pins8/MUX_nEN, sheet 8pins9/MUX_nEN, sheet 8pins10/MUX_nEN
NMOS_SHFT_1TO5_NOE: port NMOS_SHFT_1TO5_NOE, sheet 8pins1/NMOS_NOE, sheet 8pins2/NMOS_NOE, sheet 8pins3/NMOS_NOE, sheet 8pins4/NMOS_NOE, sheet 8pins5/NMOS_NOE
NMOS_SHFT_1TO5_RCLK: port NMOS_SHFT_1TO5_RCLK, sheet 8pins1/NMOS_RCLK, sheet 8pins2/NMOS_RCLK, sheet 8pins3/NMOS_RCLK, sheet 8pins4/NMOS_RCLK, sheet 8pins5/NMOS_RCLK
NMOS_SHFT_1TO5_SER: port NMOS_SHFT_1TO5_SER, sheet 8pins1/NMOS_SER
NMOS_SHFT_1TO5_SRCLK: port NMOS_SHFT_1TO5_SRCLK, sheet 8pins1/NMOS_SRCLK, sheet 8pins2/NMOS_SRCLK, sheet 8pins3/NMOS_SRCLK, sheet 8pins4/NMOS_SRCLK, sheet 8pins5/NMOS_SRCLK
NMOS_SHFT_1TO5_SRCLR: port NMOS_SHFT_1TO5_SRCLR, sheet 8pins1/NMOS_SRCLR, sheet 8pins2/NMOS_SRCLR, sheet 8pins3/NMOS_SRCLR, sheet 8pins4/NMOS_SRCLR, sheet 8pins5/NMOS_SRCLR
NMOS_SHFT_6TO10_NOE: port NMOS_SHFT_6TO10_NOE, sheet 8pins6/NMOS_NOE, sheet 8pins7/NMOS_NOE, sheet 8pins8/NMOS_NOE, sheet 8pins9/NMOS_NOE, sheet 8pins10/NMOS_NOE
NMOS_SHFT_6TO10_RCLK: port NMOS_SHFT_6TO10_RCLK, sheet 8pins6/NMOS_RCLK, sheet 8pins7/NMOS_RCLK, sheet 8pins8/NMOS_RCLK, sheet 8pins9/NMOS_RCLK, sheet 8pins10/NMOS_RCLK
NMOS_SHFT_6TO10_SER: port NMOS_SHFT_6TO10_SER, sheet 8pins6/NMOS_SER
NMOS_SHFT_6TO10_SRCLK: port NMOS_SHFT_6TO10_SRCLK, sheet 8pins6/NMOS_SRCLK, sheet 8pins7/NMOS_SRCLK, sheet 8pins8/NMOS_SRCLK, sheet 8pins9/NMOS_SRCLK, sheet 8pins10/NMOS_SRCLK
NMOS_SHFT_6TO10_SRCLR: port NMOS_SHFT_6TO10_SRCLR, sheet 8pins6/NMOS_SRCLR, sheet 8pins7/NMOS_SRCLR, sheet 8pins8/NMOS_SRCLR, sheet 8pins9/NMOS_SRCLR, sheet 8pins10/NMOS_SRCLR
PMOS_SHFT_1TO5_NOE: port PMOS_SHFT_1TO5_NOE, sheet 8pins1/PMOS_nOE, sheet 8pins2/PMOS_nOE, sheet 8pins3/PMOS_nOE, sheet 8pins4/PMOS_nOE, sheet 8pins5/PMOS_nOE
PMOS_SHFT_1TO5_RCLK: port PMOS_SHFT_1TO5_RCLK, sheet 8pins1/PMOS_RCLK, sheet 8pins2/PMOS_RCLK, sheet 8pins3/PMOS_RCLK, sheet 8pins4/PMOS_RCLK, sheet 8pins5/PMOS_RCLK
PMOS_SHFT_1TO5_SER: port PMOS_SHFT_1TO5_SER, sheet 8pins1/PMOS_SER
PMOS_SHFT_1TO5_SRCLK: port PMOS_SHFT_1TO5_SRCLK, sheet 8pins1/PMOS_SRCLK, sheet 8pins2/PMOS_SRCLK, sheet 8pins3/PMOS_SRCLK, sheet 8pins4/PMOS_SRCLK, sheet 8pins5/PMOS_SRCLK
PMOS_SHFT_1TO5_SRCLR: port PMOS_SHFT_1TO5_SRCLR, sheet 8pins1/PMOS_SRCLR, sheet 8pins2/PMOS_SRCLR, sheet 8pins3/PMOS_SRCLR, sheet 8pins4/PMOS_SRCLR, sheet 8pins5/PMOS_SRCLR
PMOS_SHFT_6TO10_NOE: port PMOS_SHFT_6TO10_NOE, sheet 8pins6/PMOS_nOE, sheet 8pins7/PMOS_nOE, sheet 8pins8/PMOS_nOE, sheet 8pins9/PMOS_nOE, sheet 8pins10/PMOS_nOE
PMOS_SHFT_6TO10_RCLK: port PMOS_SHFT_6TO10_RCLK, sheet 8pins6/PMOS_RCLK, sheet 8pins7/PMOS_RCLK, sheet 8pins8/PMOS_RCLK, sheet 8pins9/PMOS_RCLK, sheet 8pins10/PMOS_RCLK
PMOS_SHFT_6TO10_SER: port PMOS_SHFT_6TO10_SER, sheet 8pins6/PMOS_SER
PMOS_SHFT_6TO10_SRCLK: port PMOS_SHFT_6TO10_SRCLK, sheet 8pins6/PMOS_SRCLK, sheet 8pins7/PMOS_SRCLK, sheet 8pins8/PMOS_SRCLK, sheet 8pins9/PMOS_SRCLK, sheet 8pins10/PMOS_SRCLK
PMOS_SHFT_6TO10_SRCLR: port PMOS_SHFT_6TO10_SRCLR, sheet 8pins6/PMOS_SRCLR, sheet 8pins7/PMOS_SRCLR, sheet 8pins8/PMOS_SRCLR, sheet 8pins9/PMOS_SRCLR, sheet 8pins10/PMOS_SRCLR
TP_1: port TP_1, sheet 8pins1/TP_1
TP_2: port TP_2, sheet 8pins1/TP_2
TP_3: port TP_3, sheet 8pins1/TP_3
TP_4: port TP_4, sheet 8pins1/TP_4
TP_5: port TP_5, sheet 8pins1/TP_5
TP_6: port TP_6, sheet 8pins1/TP_6
TP_7: port TP_7, sheet 8pins1/TP_7
TP_8: port TP_8, sheet 8pins1/TP_8
TP_9: port TP_9, sheet 8pins2/TP_1
TP_10: port TP_10, sheet 8pins2/TP_2
TP_11: port TP_11, sheet 8pins2/TP_3
TP_12: port TP_12, sheet 8pins2/TP_4
TP_13: port TP_13, sheet 8pins2/TP_5
TP_14: port TP_14, sheet 8pins2/TP_6
TP_15: port TP_15, sheet 8pins2/TP_7
TP_16: port TP_16, sheet 8pins2/TP_8
TP_17: port TP_17, sheet 8pins3/TP_1
TP_18: port TP_18, sheet 8pins3/TP_2
TP_19: port TP_19, sheet 8pins3/TP_3
TP_20: port TP_20, sheet 8pins3/TP_4
TP_21: port TP_21, sheet 8pins3/TP_5
TP_22: port TP_22, sheet 8pins3/TP_6
TP_23: port TP_23, sheet 8pins3/TP_7
TP_24: port TP_24, sheet 8pins3/TP_8
TP_25: port TP_25, sheet 8pins4/TP_1
TP_26: port TP_26, sheet 8pins4/TP_2
TP_27: port TP_27, sheet 8pins4/TP_3
TP_28: port TP_28, sheet 8pins4/TP_4
TP_29: port TP_29, sheet 8pins4/TP_5
TP_30: port TP_30, sheet 8pins4/TP_6
TP_31: port TP_31, sheet 8pins4/TP_7
TP_32: port TP_32, sheet 8pins4/TP_8
TP_33: port TP_33, sheet 8pins5/TP_1
TP_34: port TP_34, sheet 8pins5/TP_2
TP_35: port TP_35, sheet 8pins5/TP_3
TP_36: port TP_36, sheet 8pins5/TP_4
TP_37: port TP_37, sheet 8pins5/TP_5
TP_38: port TP_38, sheet 8pins5/TP_6
TP_39: port TP_39, sheet 8pins5/TP_7
TP_40: port TP_40, sheet 8pins5/TP_8
TP_41: port TP_41, sheet 8pins6/TP_1
TP_42: port TP_42, sheet 8pins6/TP_2
TP_43: port TP_43, sheet 8pins6/TP_3
TP_44: port TP_44, sheet 8pins6/TP_4
TP_45: port TP_45, sheet 8pins6/TP_5
TP_46: port TP_46, sheet 8pins6/TP_6
TP_47: port TP_47, sheet 8pins6/TP_7
TP_48: port TP_48, sheet 8pins6/TP_8
TP_49: port TP_49, sheet 8pins7/TP_1
TP_50: port TP_50, sheet 8pins7/TP_2
TP_51: port TP_51, sheet 8pins7/TP_3
TP_52: port TP_52, sheet 8pins7/TP_4
TP_53: port TP_53, sheet 8pins7/TP_5
TP_54: port TP_54, sheet 8pins7/TP_6
TP_55: port TP_55, sheet 8pins7/TP_7
TP_56: port TP_56, sheet 8pins7/TP_8
TP_57: port TP_57, sheet 8pins8/TP_1
TP_58: port TP_58, sheet 8pins8/TP_2
TP_59: port TP_59, sheet 8pins8/TP_3
TP_60: port TP_60, sheet 8pins8/TP_4
TP_61: port TP_61, sheet 8pins8/TP_5
TP_62: port TP_62, sheet 8pins8/TP_6
TP_63: port TP_63, sheet 8pins8/TP_7
TP_64: port TP_64, sheet 8pins8/TP_8
TP_65: port TP_65, sheet 8pins9/TP_1
TP_66: port TP_66, sheet 8pins9/TP_2
TP_67: port TP_67, sheet 8pins9/TP_3
TP_68: port TP_68, sheet 8pins9/TP_4
TP_69: port TP_69, sheet 8pins9/TP_5
TP_70: port TP_70, sheet 8pins9/TP_6
TP_71: port TP_71, sheet 8pins9/TP_7
TP_72: port TP_72, sheet 8pins9/TP_8
TP_73: port TP_73, sheet 8pins10/TP_1
TP_74: port TP_74, sheet 8pins10/TP_2
TP_75: port TP_75, sheet 8pins10/TP_3
TP_76: port TP_76, sheet 8pins10/TP_4
TP_77: port TP_77, sheet 8pins10/TP_5
TP_78: port TP_78, sheet 8pins10/TP_6
TP_79: port TP_79, sheet 8pins10/TP_7
TP_80: port TP_80, sheet 8pins10/TP_8
Vcomp: port Vcomp, sheet 8pins1/Vcomp, sheet 8pins2/Vcomp, sheet 8pins3/Vcomp, sheet 8pins4/Vcomp, sheet 8pins5/Vcomp, sheet 8pins6/Vcomp, sheet 8pins7/Vcomp, sheet 8pins8/Vcomp, sheet 8pins9/Vcomp, sheet 8pins10/Vcomp
Net8pins1_U2_9: sheet 8pins1/NMOS_QH, sheet 8pins2/NMOS_SER
Net8pins1_U4_9: sheet 8pins1/PMOS_QH, sheet 8pins2/PMOS_SER
Net8pins2_U2_9: sheet 8pins2/NMOS_QH, sheet 8pins3/NMOS_SER
Net8pins2_U4_9: sheet 8pins2/PMOS_QH, sheet 8pins3/PMOS_SER
Net8pins3_U2_9: sheet 8pins3/NMOS_QH, sheet 8pins4/NMOS_SER
Net8pins3_U4_9: sheet 8pins3/PMOS_QH, sheet 8pins4/PMOS_SER
Net8pins4_U2_9: sheet 8pins4/NMOS_QH, sheet 8pins5/NMOS_SER
Net8pins4_U4_9: sheet 8pins4/PMOS_QH, sheet 8pins5/PMOS_SER
Net8pins6_U2_9: sheet 8pins6/NMOS_QH, sheet 8pins7/NMOS_SER
Net8pins6_U4_9: sheet 8pins6/PMOS_QH, sheet 8pins7/PMOS_SER
Net8pins7_U2_9: sheet 8pins7/NMOS_QH, sheet 8pins8/NMOS_SER
Net8pins7_U4_9: sheet 8pins7/PMOS_QH, sheet 8pins8/PMOS_SER
Net8pins8_U2_9: sheet 8pins8/NMOS_QH, sheet 8pins9/NMOS_SER
Net8pins8_U4_9: sheet 8pins8/PMOS_QH, sheet 8pins9/PMOS_SER
Net8pins9_U2_9: sheet 8pins9/NMOS_QH, sheet 8pins10/NMOS_SER
Net8pins9_U4_9: sheet 8pins9/PMOS_QH, sheet 8pins10/PMOS_SER

### Notes on the sheet
- ALL 80 pins - controlled by 2x5 (for P and N MOSFETS) + 2x5MUXES
- MUX for channels 1-5
- Shift reg P a N - MOS driver for channels 1-5
- MUX for channels 6-10
- Shift reg P a N - MOS driver for channels 6-10

## Sheet 8pins_together.SchDoc
size A3; DocumentNumber: 3; SheetNumber: 3; SheetTotal: 5
Used 10 times, as channels U_ALL_channels/8pins1, U_ALL_channels/8pins2, U_ALL_channels/8pins3, U_ALL_channels/8pins4, U_ALL_channels/8pins5, U_ALL_channels/8pins6, U_ALL_channels/8pins7, U_ALL_channels/8pins8, U_ALL_channels/8pins9, U_ALL_channels/8pins10. Parts and nets are listed once, with the designators drawn on the sheet.
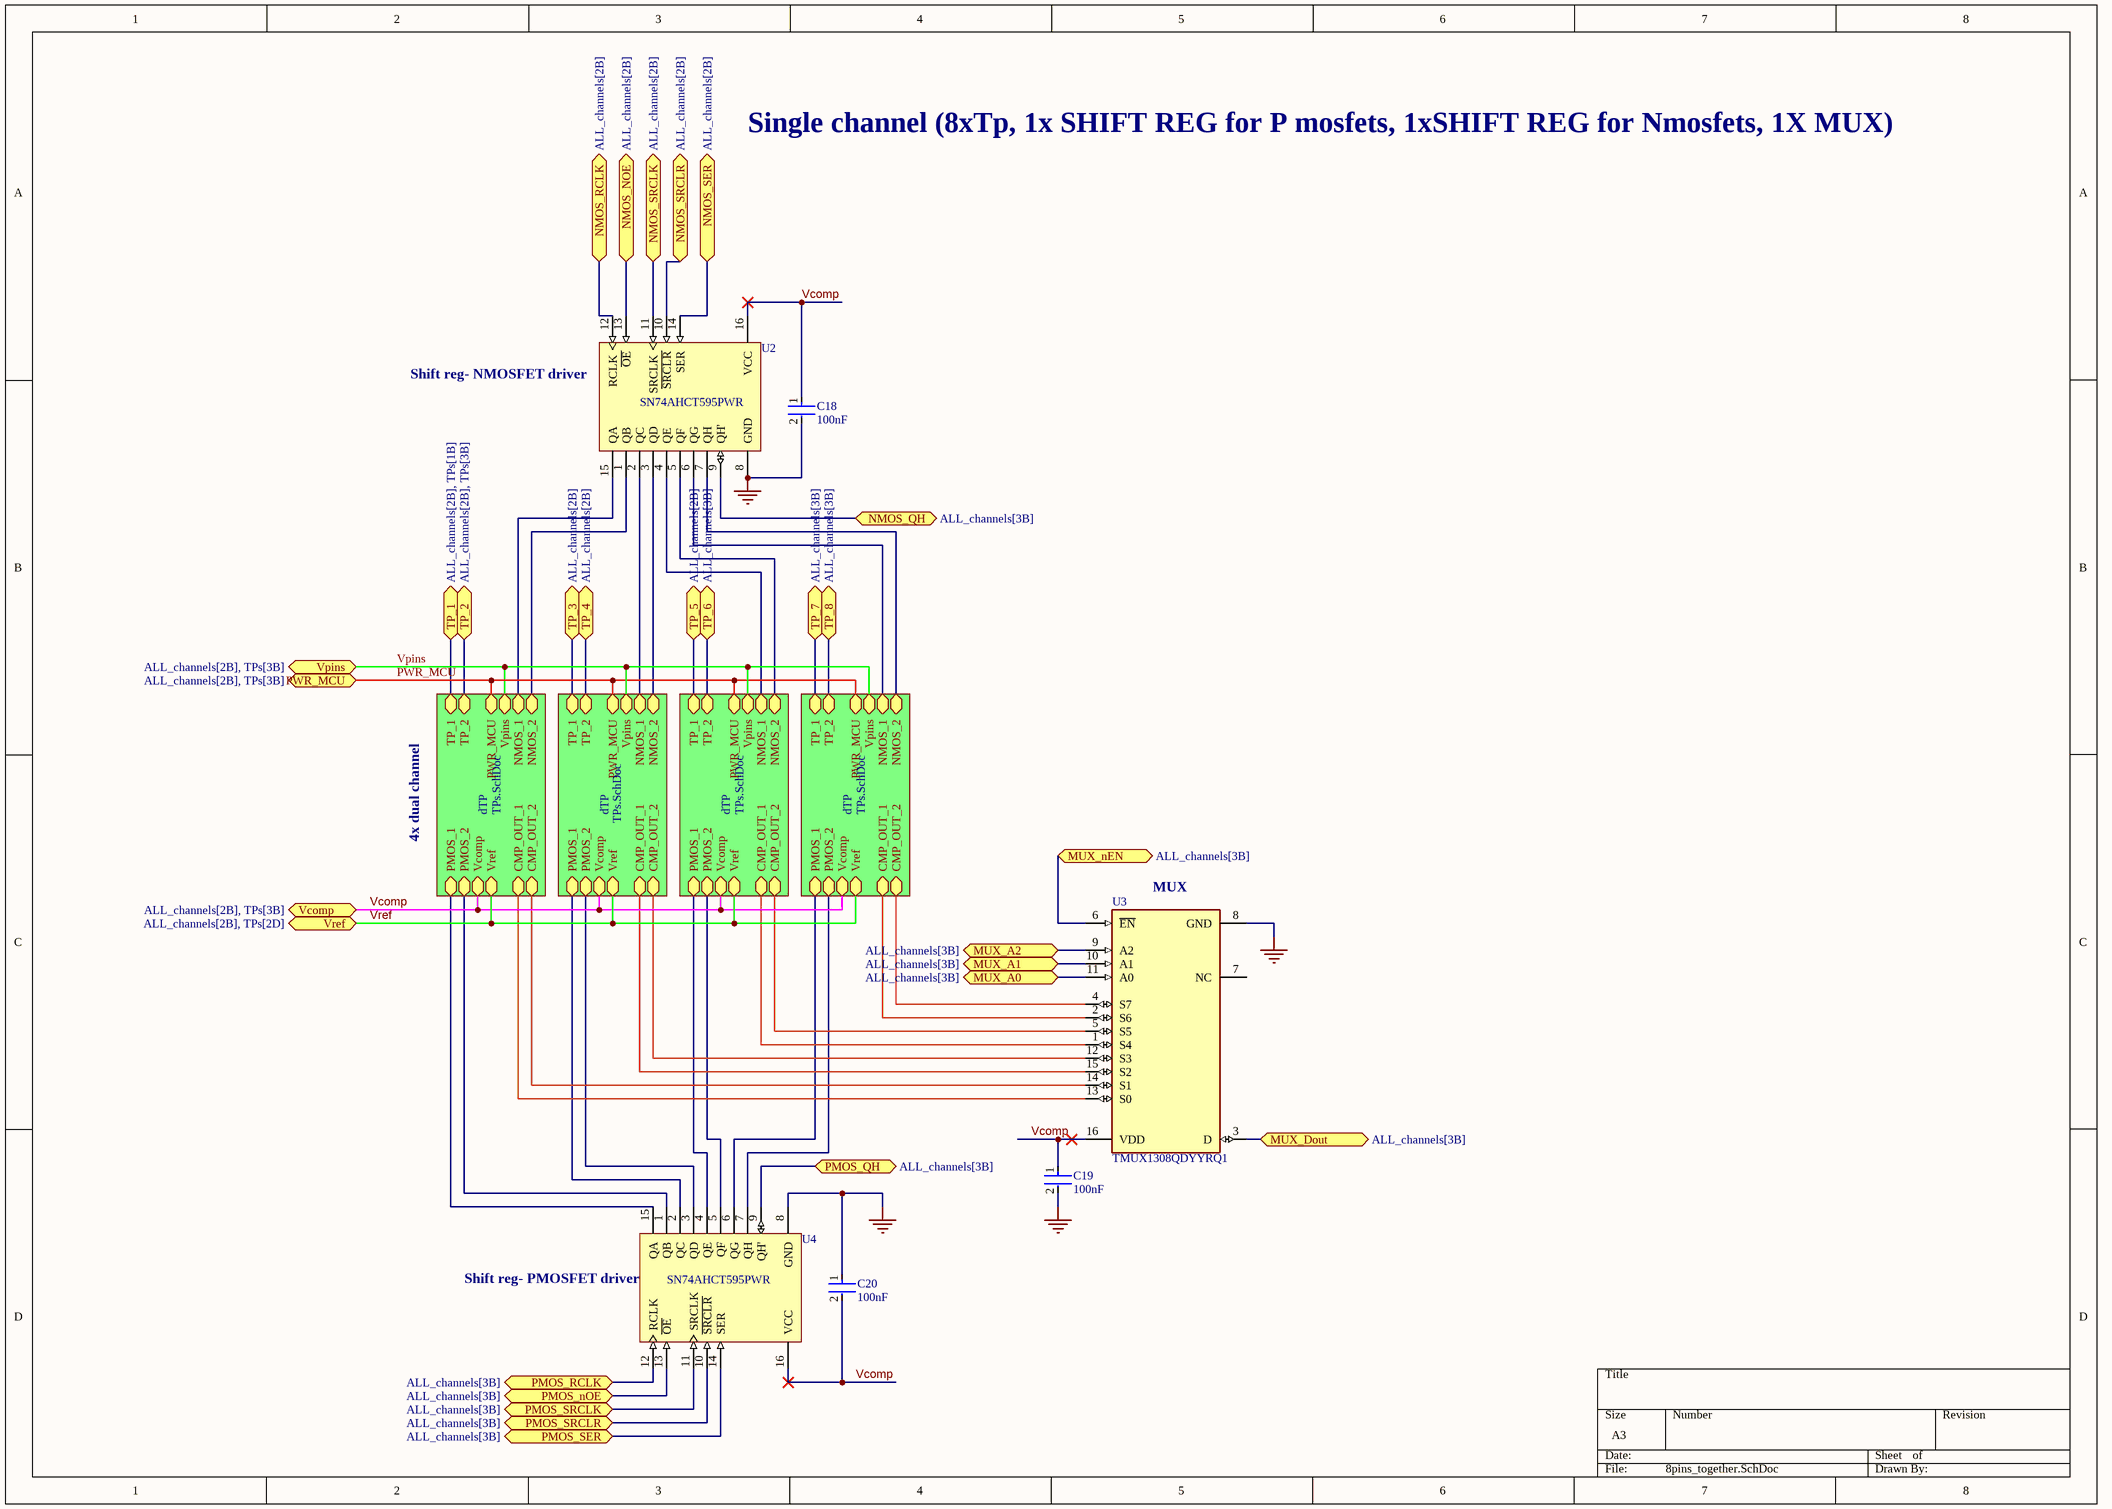
[diagram p2: 8pins_together.SchDoc]

### Parts
C18  100nF  [0402 CAP]
C19  100nF  [0402 CAP]
C20  100nF  [0402 CAP]
U2  SN74AHCT595PWR  [SSOT16]
U3  TMUX1308QDYYRQ1  [FP-DYY0016A-MFG]
U4  SN74AHCT595PWR  [SSOT16]

### Sub-sheets
dTP = TPs.SchDoc: PMOS_1 (bidir), CMP_OUT_1 (bidir), NMOS_2 (bidir), CMP_OUT_2 (bidir), PMOS_2 (bidir), NMOS_1 (bidir), TP_2 (bidir), TP_1 (bidir), Vcomp (bidir), PWR_MCU (bidir), Vref (bidir), Vpins (bidir)
dTP = TPs.SchDoc: PMOS_1 (bidir), CMP_OUT_1 (bidir), NMOS_2 (bidir), CMP_OUT_2 (bidir), PMOS_2 (bidir), NMOS_1 (bidir), TP_2 (bidir), TP_1 (bidir), Vcomp (bidir), PWR_MCU (bidir), Vref (bidir), Vpins (bidir)
dTP = TPs.SchDoc: PMOS_1 (bidir), CMP_OUT_1 (bidir), NMOS_2 (bidir), CMP_OUT_2 (bidir), PMOS_2 (bidir), NMOS_1 (bidir), TP_2 (bidir), TP_1 (bidir), Vcomp (bidir), PWR_MCU (bidir), Vref (bidir), Vpins (bidir)
dTP = TPs.SchDoc: PMOS_1 (bidir), CMP_OUT_1 (bidir), NMOS_2 (bidir), CMP_OUT_2 (bidir), PMOS_2 (bidir), NMOS_1 (bidir), TP_2 (bidir), TP_1 (bidir), Vcomp (bidir), PWR_MCU (bidir), Vref (bidir), Vpins (bidir)

### Ports
MUX_A0 (bidir, see ALL_channels[3B]), MUX_A1 (bidir, see ALL_channels[3B]), MUX_A2 (bidir, see ALL_channels[3B]), MUX_Dout (bidir, see ALL_channels[3B]), MUX_nEN (bidir, see ALL_channels[3B]), NMOS_NOE (bidir, see ALL_channels[2B]), NMOS_QH (bidir, see ALL_channels[3B]), NMOS_RCLK (bidir, see ALL_channels[2B]), NMOS_SER (bidir, see ALL_channels[2B]), NMOS_SRCLK (bidir, see ALL_channels[2B]), NMOS_SRCLR (bidir, see ALL_channels[2B]), PMOS_nOE (bidir, see ALL_channels[3B]), PMOS_QH (bidir, see ALL_channels[3B]), PMOS_RCLK (bidir, see ALL_channels[3B]), PMOS_SER (bidir, see ALL_channels[3B]), PMOS_SRCLK (bidir, see ALL_channels[3B]), PMOS_SRCLR (bidir, see ALL_channels[3B]), PWR_MCU (bidir, see ALL_channels[2B], TPs[3B]), TP_1 (bidir, see ALL_channels[2B], TPs[1B]), TP_2 (bidir, see ALL_channels[2B], TPs[3B]), TP_3 (bidir, see ALL_channels[2B]), TP_4 (bidir, see ALL_channels[2B]), TP_5 (bidir, see ALL_channels[2B]), TP_6 (bidir, see ALL_channels[3B]), TP_7 (bidir, see ALL_channels[3B]), TP_8 (bidir, see ALL_channels[3B]), Vcomp (bidir, see ALL_channels[2B], TPs[3B]), Vpins (bidir, see ALL_channels[2B], TPs[3B]), Vref (bidir, see ALL_channels[2B], TPs[2D])

### Nets
GND: C18.2 C19.2 C20.1 U2.8(GND) U3.8(GND) U4.8(GND)
MUX_A0: U3.11(A0) ; port MUX_A0
MUX_A1: U3.10(A1) ; port MUX_A1
MUX_A2: U3.9(A2) ; port MUX_A2
MUX_Dout: U3.3(D) ; port MUX_Dout
MUX_nEN: U3.6(~{EN}) ; port MUX_nEN
NMOS_NOE: U2.13(~{OE}) ; port NMOS_NOE
NMOS_QH: U2.9(QH') ; port NMOS_QH
NMOS_RCLK: U2.12(RCLK) ; port NMOS_RCLK
NMOS_SER: U2.14(SER) ; port NMOS_SER
NMOS_SRCLK: U2.11(SRCLK) ; port NMOS_SRCLK
NMOS_SRCLR: U2.10(~{SRCLR}) ; port NMOS_SRCLR
PMOS_nOE: U4.13(~{OE}) ; port PMOS_nOE
PMOS_QH: U4.9(QH') ; port PMOS_QH
PMOS_RCLK: U4.12(RCLK) ; port PMOS_RCLK
PMOS_SER: U4.14(SER) ; port PMOS_SER
PMOS_SRCLK: U4.11(SRCLK) ; port PMOS_SRCLK
PMOS_SRCLR: U4.10(~{SRCLR}) ; port PMOS_SRCLR
PWR_MCU: port PWR_MCU, sheet dTP/PWR_MCU, sheet dTP/PWR_MCU, sheet dTP/PWR_MCU, sheet dTP/PWR_MCU
TP_1: port TP_1, sheet dTP/TP_1
TP_2: port TP_2, sheet dTP/TP_2
TP_3: port TP_3, sheet dTP/TP_1
TP_4: port TP_4, sheet dTP/TP_2
TP_5: port TP_5, sheet dTP/TP_1
TP_6: port TP_6, sheet dTP/TP_2
TP_7: port TP_7, sheet dTP/TP_1
TP_8: port TP_8, sheet dTP/TP_2
Vcomp: C18.1 C19.1 C20.2 U2.16(VCC) U3.16(VDD) U4.16(VCC) ; port Vcomp, sheet dTP/Vcomp, sheet dTP/Vcomp, sheet dTP/Vcomp, sheet dTP/Vcomp
Vpins: port Vpins, sheet dTP/Vpins, sheet dTP/Vpins, sheet dTP/Vpins, sheet dTP/Vpins
Vref: port Vref, sheet dTP/Vref, sheet dTP/Vref, sheet dTP/Vref, sheet dTP/Vref
NetU2_1: U2.1(QB) ; sheet dTP/NMOS_2
NetU2_2: U2.2(QC) ; sheet dTP/NMOS_1
NetU2_3: U2.3(QD) ; sheet dTP/NMOS_2
NetU2_4: U2.4(QE) ; sheet dTP/NMOS_1
NetU2_5: U2.5(QF) ; sheet dTP/NMOS_2
NetU2_6: U2.6(QG) ; sheet dTP/NMOS_1
NetU2_7: U2.7(QH) ; sheet dTP/NMOS_2
NetU2_15: U2.15(QA) ; sheet dTP/NMOS_1
NetU3_1: U3.1(S4) ; sheet dTP/CMP_OUT_1
NetU3_2: U3.2(S6) ; sheet dTP/CMP_OUT_1
NetU3_4: U3.4(S7) ; sheet dTP/CMP_OUT_2
NetU3_5: U3.5(S5) ; sheet dTP/CMP_OUT_2
NetU3_12: U3.12(S3) ; sheet dTP/CMP_OUT_2
NetU3_13: U3.13(S0) ; sheet dTP/CMP_OUT_1
NetU3_14: U3.14(S1) ; sheet dTP/CMP_OUT_2
NetU3_15: U3.15(S2) ; sheet dTP/CMP_OUT_1
NetU4_1: U4.1(QB) ; sheet dTP/PMOS_2
NetU4_2: U4.2(QC) ; sheet dTP/PMOS_1
NetU4_3: U4.3(QD) ; sheet dTP/PMOS_2
NetU4_4: U4.4(QE) ; sheet dTP/PMOS_1
NetU4_5: U4.5(QF) ; sheet dTP/PMOS_2
NetU4_6: U4.6(QG) ; sheet dTP/PMOS_1
NetU4_7: U4.7(QH) ; sheet dTP/PMOS_2
NetU4_15: U4.15(QA) ; sheet dTP/PMOS_1

Not connected (* = marked no-connect by the designer): U3 7(NC)

### Channels
U_ALL_channels/8pins1: designators C18=8pins1_C18 C19=8pins1_C19 C20=8pins1_C20 U2=8pins1_U2 U3=8pins1_U3 U4=8pins1_U4; ports MUX_A0=MUXes_1to5__A0 MUX_A1=MUXes_1to5__A1 MUX_A2=MUXes_1to5__A2 MUX_Dout=MUX_D_1 MUX_nEN=MUXes_1to5_nEN NMOS_NOE=NMOS_SHFT_1TO5_NOE NMOS_QH=Net8pins1_U2_9 NMOS_RCLK=NMOS_SHFT_1TO5_RCLK NMOS_SER=NMOS_SHFT_1TO5_SER NMOS_SRCLK=NMOS_SHFT_1TO5_SRCLK NMOS_SRCLR=NMOS_SHFT_1TO5_SRCLR PMOS_nOE=PMOS_SHFT_1TO5_NOE PMOS_QH=Net8pins1_U4_9 PMOS_RCLK=PMOS_SHFT_1TO5_RCLK PMOS_SER=PMOS_SHFT_1TO5_SER PMOS_SRCLK=PMOS_SHFT_1TO5_SRCLK PMOS_SRCLR=PMOS_SHFT_1TO5_SRCLR PWR_MCU=PWR_MCU TP_1=TP_1 TP_2=TP_2 TP_3=TP_3 TP_4=TP_4 TP_5=TP_5 TP_6=TP_6 TP_7=TP_7 TP_8=TP_8 Vcomp=Vcomp Vpins=Vpins Vref=Vref
U_ALL_channels/8pins2: designators C18=8pins2_C18 C19=8pins2_C19 C20=8pins2_C20 U2=8pins2_U2 U3=8pins2_U3 U4=8pins2_U4; ports MUX_A0=MUXes_1to5__A0 MUX_A1=MUXes_1to5__A1 MUX_A2=MUXes_1to5__A2 MUX_Dout=MUX_D_2 MUX_nEN=MUXes_1to5_nEN NMOS_NOE=NMOS_SHFT_1TO5_NOE NMOS_QH=Net8pins2_U2_9 NMOS_RCLK=NMOS_SHFT_1TO5_RCLK NMOS_SER=Net8pins1_U2_9 NMOS_SRCLK=NMOS_SHFT_1TO5_SRCLK NMOS_SRCLR=NMOS_SHFT_1TO5_SRCLR PMOS_nOE=PMOS_SHFT_1TO5_NOE PMOS_QH=Net8pins2_U4_9 PMOS_RCLK=PMOS_SHFT_1TO5_RCLK PMOS_SER=Net8pins1_U4_9 PMOS_SRCLK=PMOS_SHFT_1TO5_SRCLK PMOS_SRCLR=PMOS_SHFT_1TO5_SRCLR PWR_MCU=PWR_MCU TP_1=TP_9 TP_2=TP_10 TP_3=TP_11 TP_4=TP_12 TP_5=TP_13 TP_6=TP_14 TP_7=TP_15 TP_8=TP_16 Vcomp=Vcomp Vpins=Vpins Vref=Vref
U_ALL_channels/8pins3: designators C18=8pins3_C18 C19=8pins3_C19 C20=8pins3_C20 U2=8pins3_U2 U3=8pins3_U3 U4=8pins3_U4; ports MUX_A0=MUXes_1to5__A0 MUX_A1=MUXes_1to5__A1 MUX_A2=MUXes_1to5__A2 MUX_Dout=MUX_D_3 MUX_nEN=MUXes_1to5_nEN NMOS_NOE=NMOS_SHFT_1TO5_NOE NMOS_QH=Net8pins3_U2_9 NMOS_RCLK=NMOS_SHFT_1TO5_RCLK NMOS_SER=Net8pins2_U2_9 NMOS_SRCLK=NMOS_SHFT_1TO5_SRCLK NMOS_SRCLR=NMOS_SHFT_1TO5_SRCLR PMOS_nOE=PMOS_SHFT_1TO5_NOE PMOS_QH=Net8pins3_U4_9 PMOS_RCLK=PMOS_SHFT_1TO5_RCLK PMOS_SER=Net8pins2_U4_9 PMOS_SRCLK=PMOS_SHFT_1TO5_SRCLK PMOS_SRCLR=PMOS_SHFT_1TO5_SRCLR PWR_MCU=PWR_MCU TP_1=TP_17 TP_2=TP_18 TP_3=TP_19 TP_4=TP_20 TP_5=TP_21 TP_6=TP_22 TP_7=TP_23 TP_8=TP_24 Vcomp=Vcomp Vpins=Vpins Vref=Vref
U_ALL_channels/8pins4: designators C18=8pins4_C18 C19=8pins4_C19 C20=8pins4_C20 U2=8pins4_U2 U3=8pins4_U3 U4=8pins4_U4; ports MUX_A0=MUXes_1to5__A0 MUX_A1=MUXes_1to5__A1 MUX_A2=MUXes_1to5__A2 MUX_Dout=MUX_D_4 MUX_nEN=MUXes_1to5_nEN NMOS_NOE=NMOS_SHFT_1TO5_NOE NMOS_QH=Net8pins4_U2_9 NMOS_RCLK=NMOS_SHFT_1TO5_RCLK NMOS_SER=Net8pins3_U2_9 NMOS_SRCLK=NMOS_SHFT_1TO5_SRCLK NMOS_SRCLR=NMOS_SHFT_1TO5_SRCLR PMOS_nOE=PMOS_SHFT_1TO5_NOE PMOS_QH=Net8pins4_U4_9 PMOS_RCLK=PMOS_SHFT_1TO5_RCLK PMOS_SER=Net8pins3_U4_9 PMOS_SRCLK=PMOS_SHFT_1TO5_SRCLK PMOS_SRCLR=PMOS_SHFT_1TO5_SRCLR PWR_MCU=PWR_MCU TP_1=TP_25 TP_2=TP_26 TP_3=TP_27 TP_4=TP_28 TP_5=TP_29 TP_6=TP_30 TP_7=TP_31 TP_8=TP_32 Vcomp=Vcomp Vpins=Vpins Vref=Vref
U_ALL_channels/8pins5: designators C18=8pins5_C18 C19=8pins5_C19 C20=8pins5_C20 U2=8pins5_U2 U3=8pins5_U3 U4=8pins5_U4; ports MUX_A0=MUXes_1to5__A0 MUX_A1=MUXes_1to5__A1 MUX_A2=MUXes_1to5__A2 MUX_Dout=MUX_D_5 MUX_nEN=MUXes_1to5_nEN NMOS_NOE=NMOS_SHFT_1TO5_NOE NMOS_QH=Net8pins5_U2_9 NMOS_RCLK=NMOS_SHFT_1TO5_RCLK NMOS_SER=Net8pins4_U2_9 NMOS_SRCLK=NMOS_SHFT_1TO5_SRCLK NMOS_SRCLR=NMOS_SHFT_1TO5_SRCLR PMOS_nOE=PMOS_SHFT_1TO5_NOE PMOS_QH=Net8pins5_U4_9 PMOS_RCLK=PMOS_SHFT_1TO5_RCLK PMOS_SER=Net8pins4_U4_9 PMOS_SRCLK=PMOS_SHFT_1TO5_SRCLK PMOS_SRCLR=PMOS_SHFT_1TO5_SRCLR PWR_MCU=PWR_MCU TP_1=TP_33 TP_2=TP_34 TP_3=TP_35 TP_4=TP_36 TP_5=TP_37 TP_6=TP_38 TP_7=TP_39 TP_8=TP_40 Vcomp=Vcomp Vpins=Vpins Vref=Vref
U_ALL_channels/8pins6: designators C18=8pins6_C18 C19=8pins6_C19 C20=8pins6_C20 U2=8pins6_U2 U3=8pins6_U3 U4=8pins6_U4; ports MUX_A0=MUXes_6TO10_A0 MUX_A1=MUXes_6TO10_A2 MUX_A2=MUXes_6TO10_A1 MUX_Dout=MUX_D_6 MUX_nEN=MUXes_6TO10_nEN NMOS_NOE=NMOS_SHFT_6TO10_NOE NMOS_QH=Net8pins6_U2_9 NMOS_RCLK=NMOS_SHFT_6TO10_RCLK NMOS_SER=NMOS_SHFT_6TO10_SER NMOS_SRCLK=NMOS_SHFT_6TO10_SRCLK NMOS_SRCLR=NMOS_SHFT_6TO10_SRCLR PMOS_nOE=PMOS_SHFT_6TO10_NOE PMOS_QH=Net8pins6_U4_9 PMOS_RCLK=PMOS_SHFT_6TO10_RCLK PMOS_SER=PMOS_SHFT_6TO10_SER PMOS_SRCLK=PMOS_SHFT_6TO10_SRCLK PMOS_SRCLR=PMOS_SHFT_6TO10_SRCLR PWR_MCU=PWR_MCU TP_1=TP_41 TP_2=TP_42 TP_3=TP_43 TP_4=TP_44 TP_5=TP_45 TP_6=TP_46 TP_7=TP_47 TP_8=TP_48 Vcomp=Vcomp Vpins=Vpins Vref=Vref
U_ALL_channels/8pins7: designators C18=8pins7_C18 C19=8pins7_C19 C20=8pins7_C20 U2=8pins7_U2 U3=8pins7_U3 U4=8pins7_U4; ports MUX_A0=MUXes_6TO10_A0 MUX_A1=MUXes_6TO10_A2 MUX_A2=MUXes_6TO10_A1 MUX_Dout=MUX_D_7 MUX_nEN=MUXes_6TO10_nEN NMOS_NOE=NMOS_SHFT_6TO10_NOE NMOS_QH=Net8pins7_U2_9 NMOS_RCLK=NMOS_SHFT_6TO10_RCLK NMOS_SER=Net8pins6_U2_9 NMOS_SRCLK=NMOS_SHFT_6TO10_SRCLK NMOS_SRCLR=NMOS_SHFT_6TO10_SRCLR PMOS_nOE=PMOS_SHFT_6TO10_NOE PMOS_QH=Net8pins7_U4_9 PMOS_RCLK=PMOS_SHFT_6TO10_RCLK PMOS_SER=Net8pins6_U4_9 PMOS_SRCLK=PMOS_SHFT_6TO10_SRCLK PMOS_SRCLR=PMOS_SHFT_6TO10_SRCLR PWR_MCU=PWR_MCU TP_1=TP_49 TP_2=TP_50 TP_3=TP_51 TP_4=TP_52 TP_5=TP_53 TP_6=TP_54 TP_7=TP_55 TP_8=TP_56 Vcomp=Vcomp Vpins=Vpins Vref=Vref
U_ALL_channels/8pins8: designators C18=8pins8_C18 C19=8pins8_C19 C20=8pins8_C20 U2=8pins8_U2 U3=8pins8_U3 U4=8pins8_U4; ports MUX_A0=MUXes_6TO10_A0 MUX_A1=MUXes_6TO10_A2 MUX_A2=MUXes_6TO10_A1 MUX_Dout=MUX_D_8 MUX_nEN=MUXes_6TO10_nEN NMOS_NOE=NMOS_SHFT_6TO10_NOE NMOS_QH=Net8pins8_U2_9 NMOS_RCLK=NMOS_SHFT_6TO10_RCLK NMOS_SER=Net8pins7_U2_9 NMOS_SRCLK=NMOS_SHFT_6TO10_SRCLK NMOS_SRCLR=NMOS_SHFT_6TO10_SRCLR PMOS_nOE=PMOS_SHFT_6TO10_NOE PMOS_QH=Net8pins8_U4_9 PMOS_RCLK=PMOS_SHFT_6TO10_RCLK PMOS_SER=Net8pins7_U4_9 PMOS_SRCLK=PMOS_SHFT_6TO10_SRCLK PMOS_SRCLR=PMOS_SHFT_6TO10_SRCLR PWR_MCU=PWR_MCU TP_1=TP_57 TP_2=TP_58 TP_3=TP_59 TP_4=TP_60 TP_5=TP_61 TP_6=TP_62 TP_7=TP_63 TP_8=TP_64 Vcomp=Vcomp Vpins=Vpins Vref=Vref
U_ALL_channels/8pins9: designators C18=8pins9_C18 C19=8pins9_C19 C20=8pins9_C20 U2=8pins9_U2 U3=8pins9_U3 U4=8pins9_U4; ports MUX_A0=MUXes_6TO10_A0 MUX_A1=MUXes_6TO10_A2 MUX_A2=MUXes_6TO10_A1 MUX_Dout=MUX_D_9 MUX_nEN=MUXes_6TO10_nEN NMOS_NOE=NMOS_SHFT_6TO10_NOE NMOS_QH=Net8pins9_U2_9 NMOS_RCLK=NMOS_SHFT_6TO10_RCLK NMOS_SER=Net8pins8_U2_9 NMOS_SRCLK=NMOS_SHFT_6TO10_SRCLK NMOS_SRCLR=NMOS_SHFT_6TO10_SRCLR PMOS_nOE=PMOS_SHFT_6TO10_NOE PMOS_QH=Net8pins9_U4_9 PMOS_RCLK=PMOS_SHFT_6TO10_RCLK PMOS_SER=Net8pins8_U4_9 PMOS_SRCLK=PMOS_SHFT_6TO10_SRCLK PMOS_SRCLR=PMOS_SHFT_6TO10_SRCLR PWR_MCU=PWR_MCU TP_1=TP_65 TP_2=TP_66 TP_3=TP_67 TP_4=TP_68 TP_5=TP_69 TP_6=TP_70 TP_7=TP_71 TP_8=TP_72 Vcomp=Vcomp Vpins=Vpins Vref=Vref
U_ALL_channels/8pins10: designators C18=8pins10_C18 C19=8pins10_C19 C20=8pins10_C20 U2=8pins10_U2 U3=8pins10_U3 U4=8pins10_U4; ports MUX_A0=MUXes_6TO10_A0 MUX_A1=MUXes_6TO10_A2 MUX_A2=MUXes_6TO10_A1 MUX_Dout=MUX_D_10 MUX_nEN=MUXes_6TO10_nEN NMOS_NOE=NMOS_SHFT_6TO10_NOE NMOS_QH=Net8pins10_U2_9 NMOS_RCLK=NMOS_SHFT_6TO10_RCLK NMOS_SER=Net8pins9_U2_9 NMOS_SRCLK=NMOS_SHFT_6TO10_SRCLK NMOS_SRCLR=NMOS_SHFT_6TO10_SRCLR PMOS_nOE=PMOS_SHFT_6TO10_NOE PMOS_QH=Net8pins10_U4_9 PMOS_RCLK=PMOS_SHFT_6TO10_RCLK PMOS_SER=Net8pins9_U4_9 PMOS_SRCLK=PMOS_SHFT_6TO10_SRCLK PMOS_SRCLR=PMOS_SHFT_6TO10_SRCLR PWR_MCU=PWR_MCU TP_1=TP_73 TP_2=TP_74 TP_3=TP_75 TP_4=TP_76 TP_5=TP_77 TP_6=TP_78 TP_7=TP_79 TP_8=TP_80 Vcomp=Vcomp Vpins=Vpins Vref=Vref

### Notes on the sheet
- Single channel (8xTp, 1x SHIFT REG for P mosfets, 1xSHIFT REG for Nmosfets, 1X MUX)
- (near U2) Shift reg- NMOSFET driver
- 4x dual channel
- (near U3) MUX
- (near U4) Shift reg- PMOSFET driver

### Library data of the parts
C18-C20 = Capacitor 0402 25V: Cap Ceramic 0.1uF 25V X7R 10% Pad SMD 0402 125C T/R; Manufacturer: Kemet; Manufacturer Part Number: C0402C104K3RACTU; Value: 0.10 μF; Temperature Coefficient: 15%; Tolerance: 0.1; Temperature: -55°C to +125°C; Automotive: No; Height: 0.55mm; Package: C0402-BB; Category: Cap; Temperature Range Low: -55°C; Device Class L2: Capacitors; Temperature Characteristic: X7R; Lead Free: Yes; Material: Ceramic; Mouser Description: Cap Ceramic 0.1uF 25V X7R 10% Pad SMD 0402 125C T/R; Temperature Range High: +125°C; Digikey Description: Cap Ceramic 0.1uF 25V X7R 10% Pad SMD 0402 125C T/R; Ipc Land Pattern Name: CAPC10050X50; Voltage Rating: 25 V; ComponentLink2URL: https://content.kemet.com/datasheets/KEM_C1002_X7R_SMD.pdf; Device Class L3: Ceramic Capacitors; RoHS: TRUE; Capacitance: 0.10 μF; Device Class L1: Passive Components; Octopart: https://octopart.com/c0402c104k3ractu-kemet-71105629; ComponentLink2Description: Datasheet
U2 U4 = SN74AHCT595PWR: 8-Bit Shift Registers With 3-State Output Registers, PW0016A, LARGE T&R; Manufacturer: Texas Instruments; F @ Nom Voltage(Max)(Mhz): 70; Bits: 8; Output Drive (IOL/IOH)(Max)(mA): 8/-8; Technology Family: AHCT; ICC @ Nom Voltage(Max)(mA): 0.04; 3-State Output: Yes; VCC(Max)(V): 5.5; Voltage(Nom)(V): 5; VCC(Min)(V): 4.5; Output Type: CMOS; Rating: Catalog; Input Type: TTL; tpd @ Nom Voltage(Max)(ns): 11.4; PackageVersion: http://www.ti.com/lit/ml/mpds361/mpds361.pdf; PackageReference: PW0016A; Code_JEDEC: MO-153; Operating Temperature Range(C): -40 to 85; DatasheetVersion: SCLS374N; Generic Part Number: SN74AHCT595
U3 = TMUX1308QDYYRQ1: AUTOMOTIVE, 5-V, 8:1, 1-CHANNEL; RoHS Compliant: Yes